# EAGLE board TellitShieldV45JR (EAGLE 5.11)
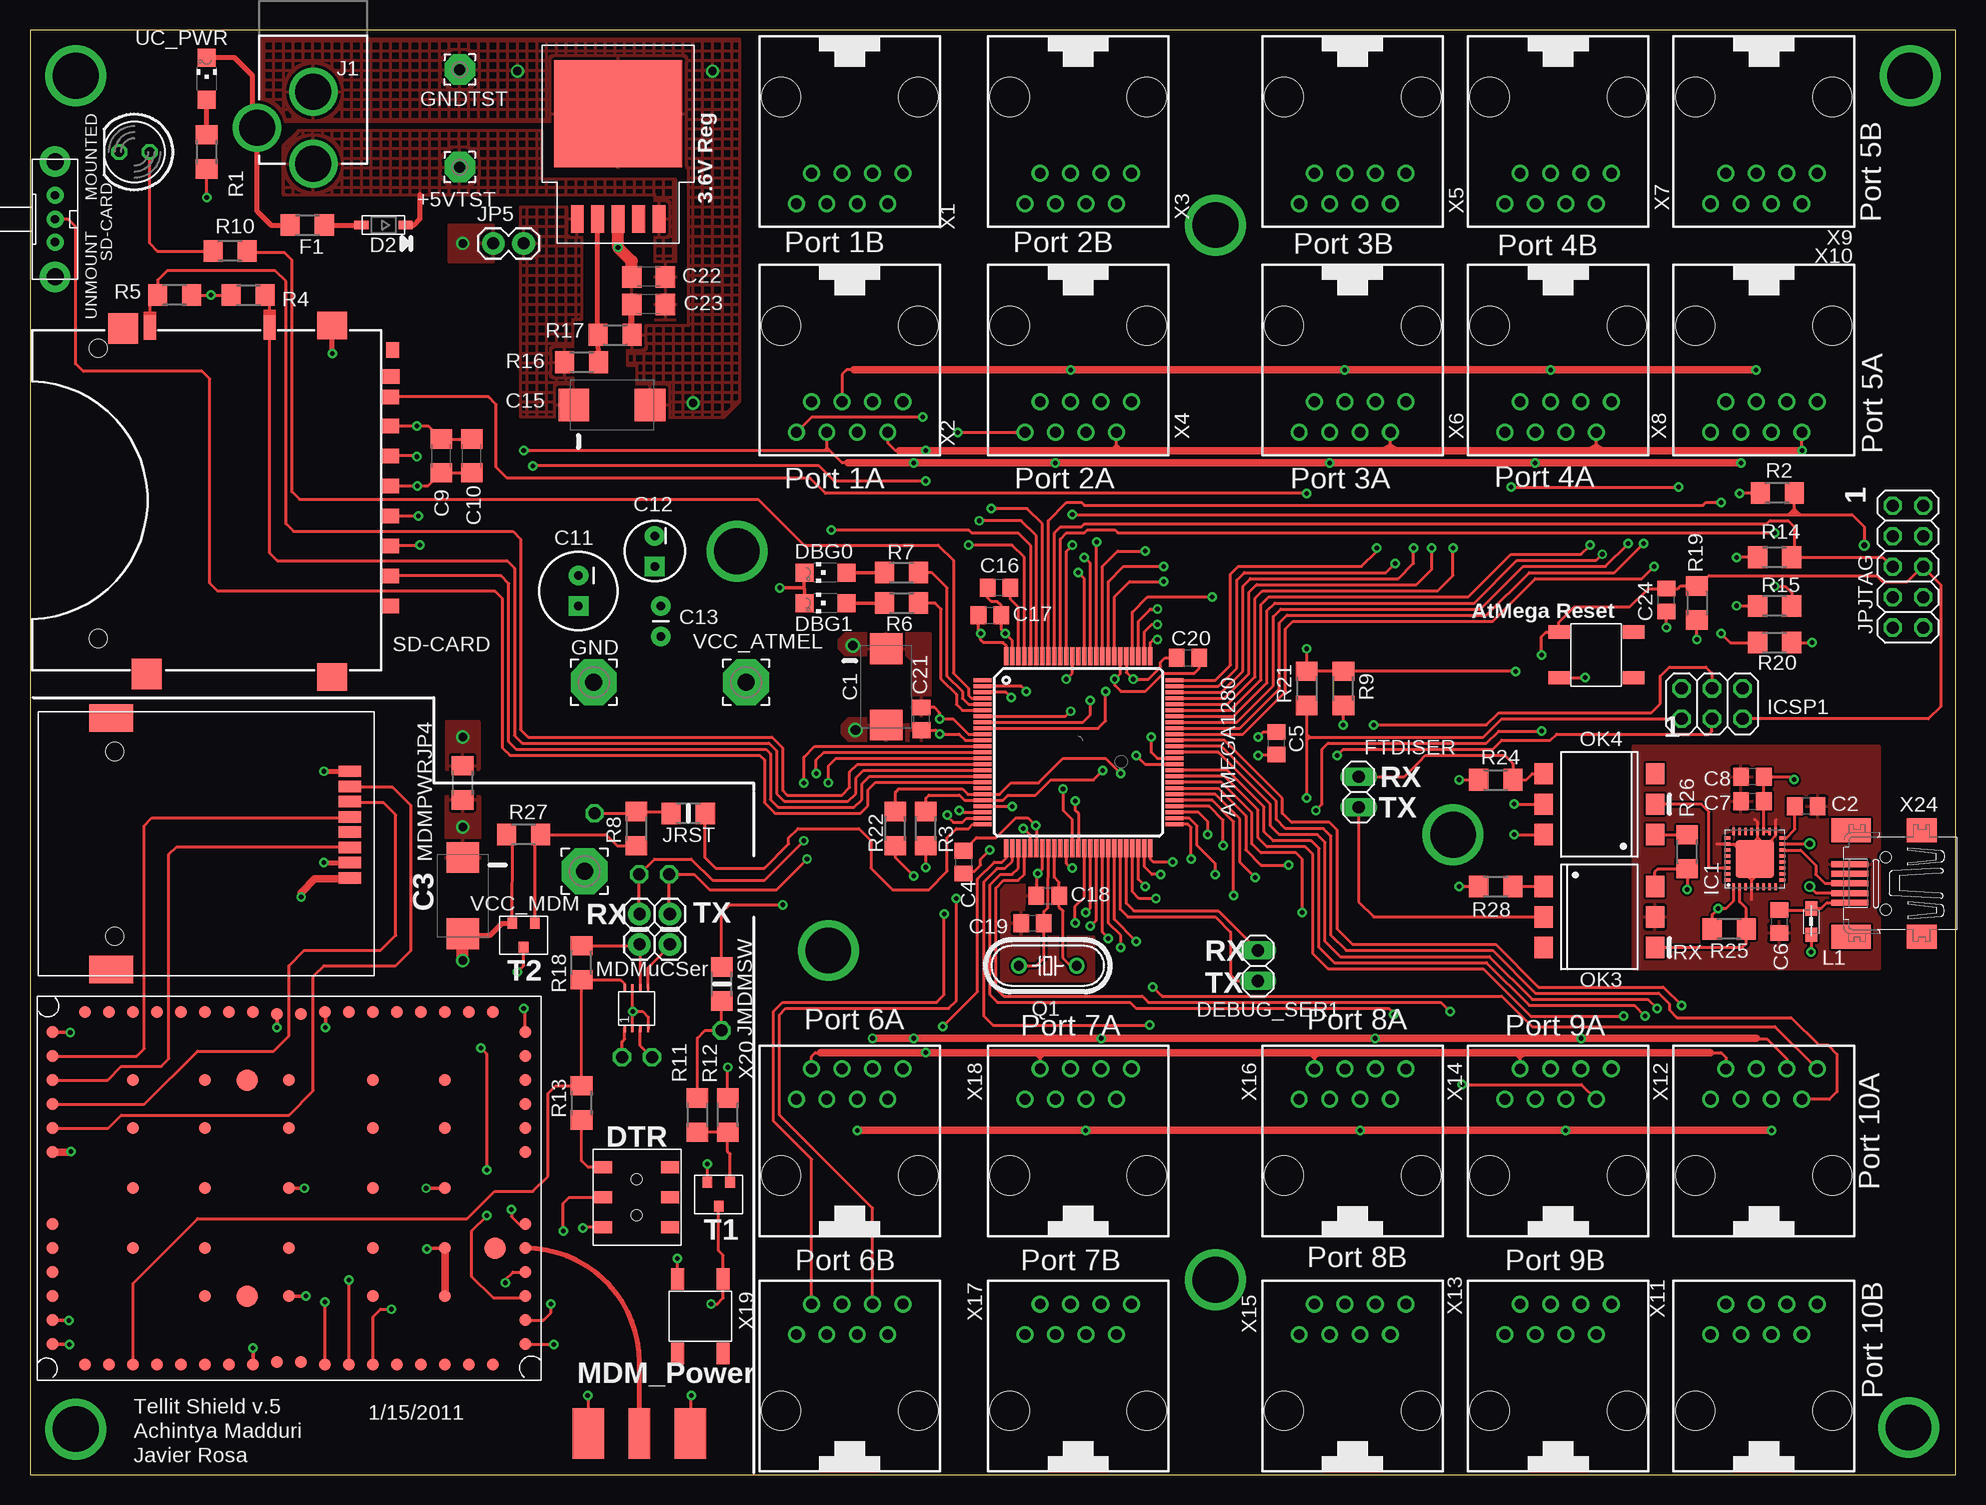
[diagram p2: board, top side]
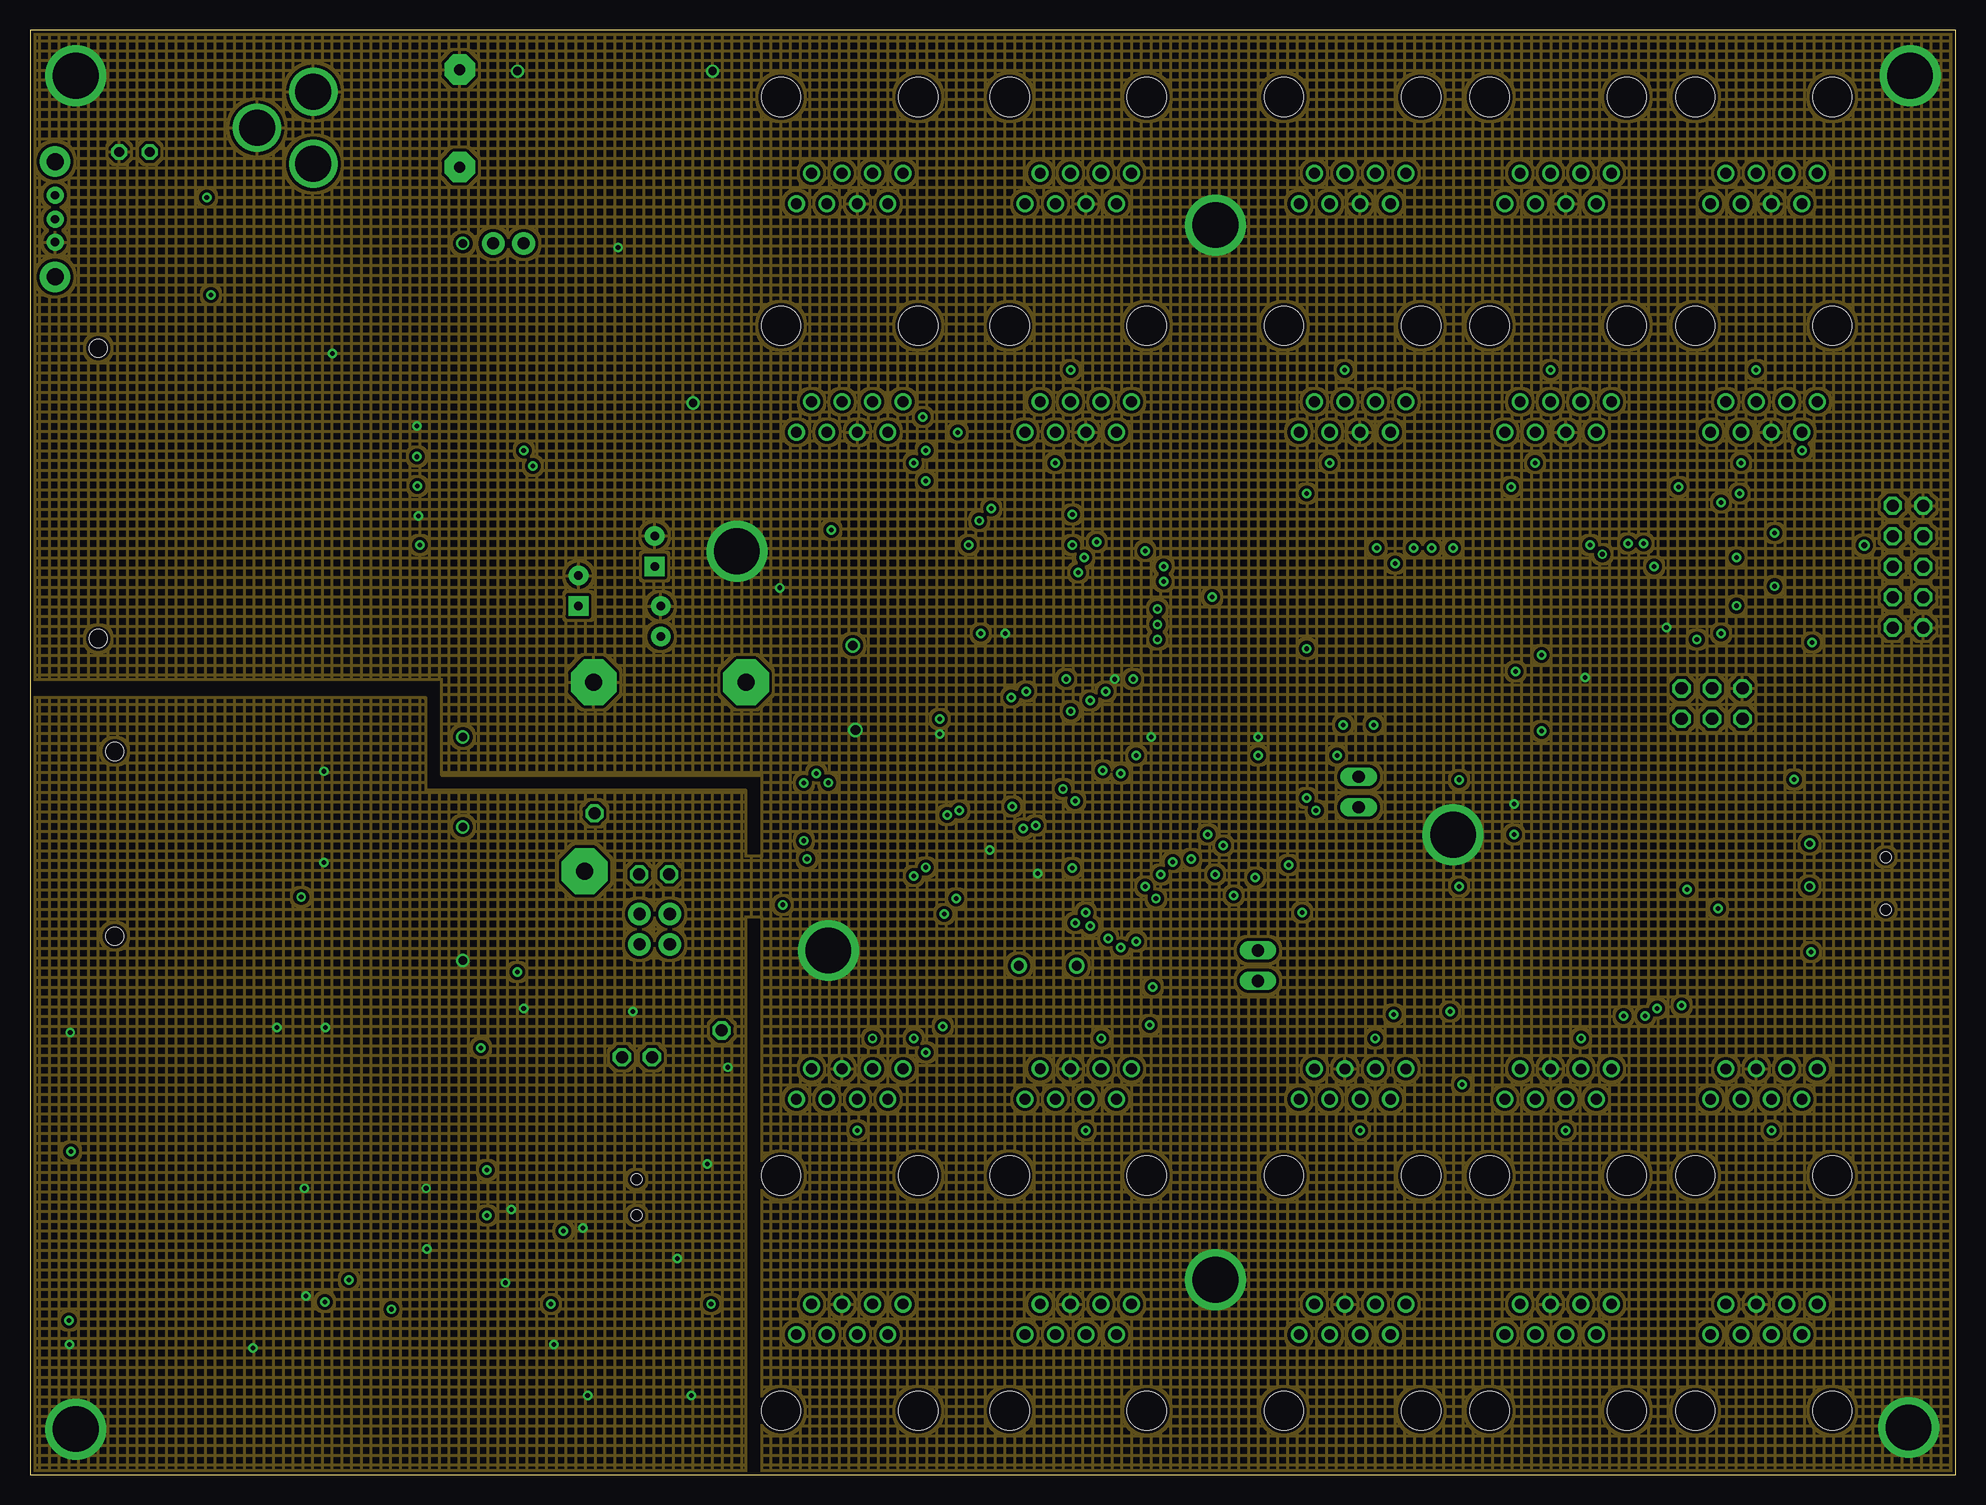
[diagram p3: board, inner layer GNDLayer]
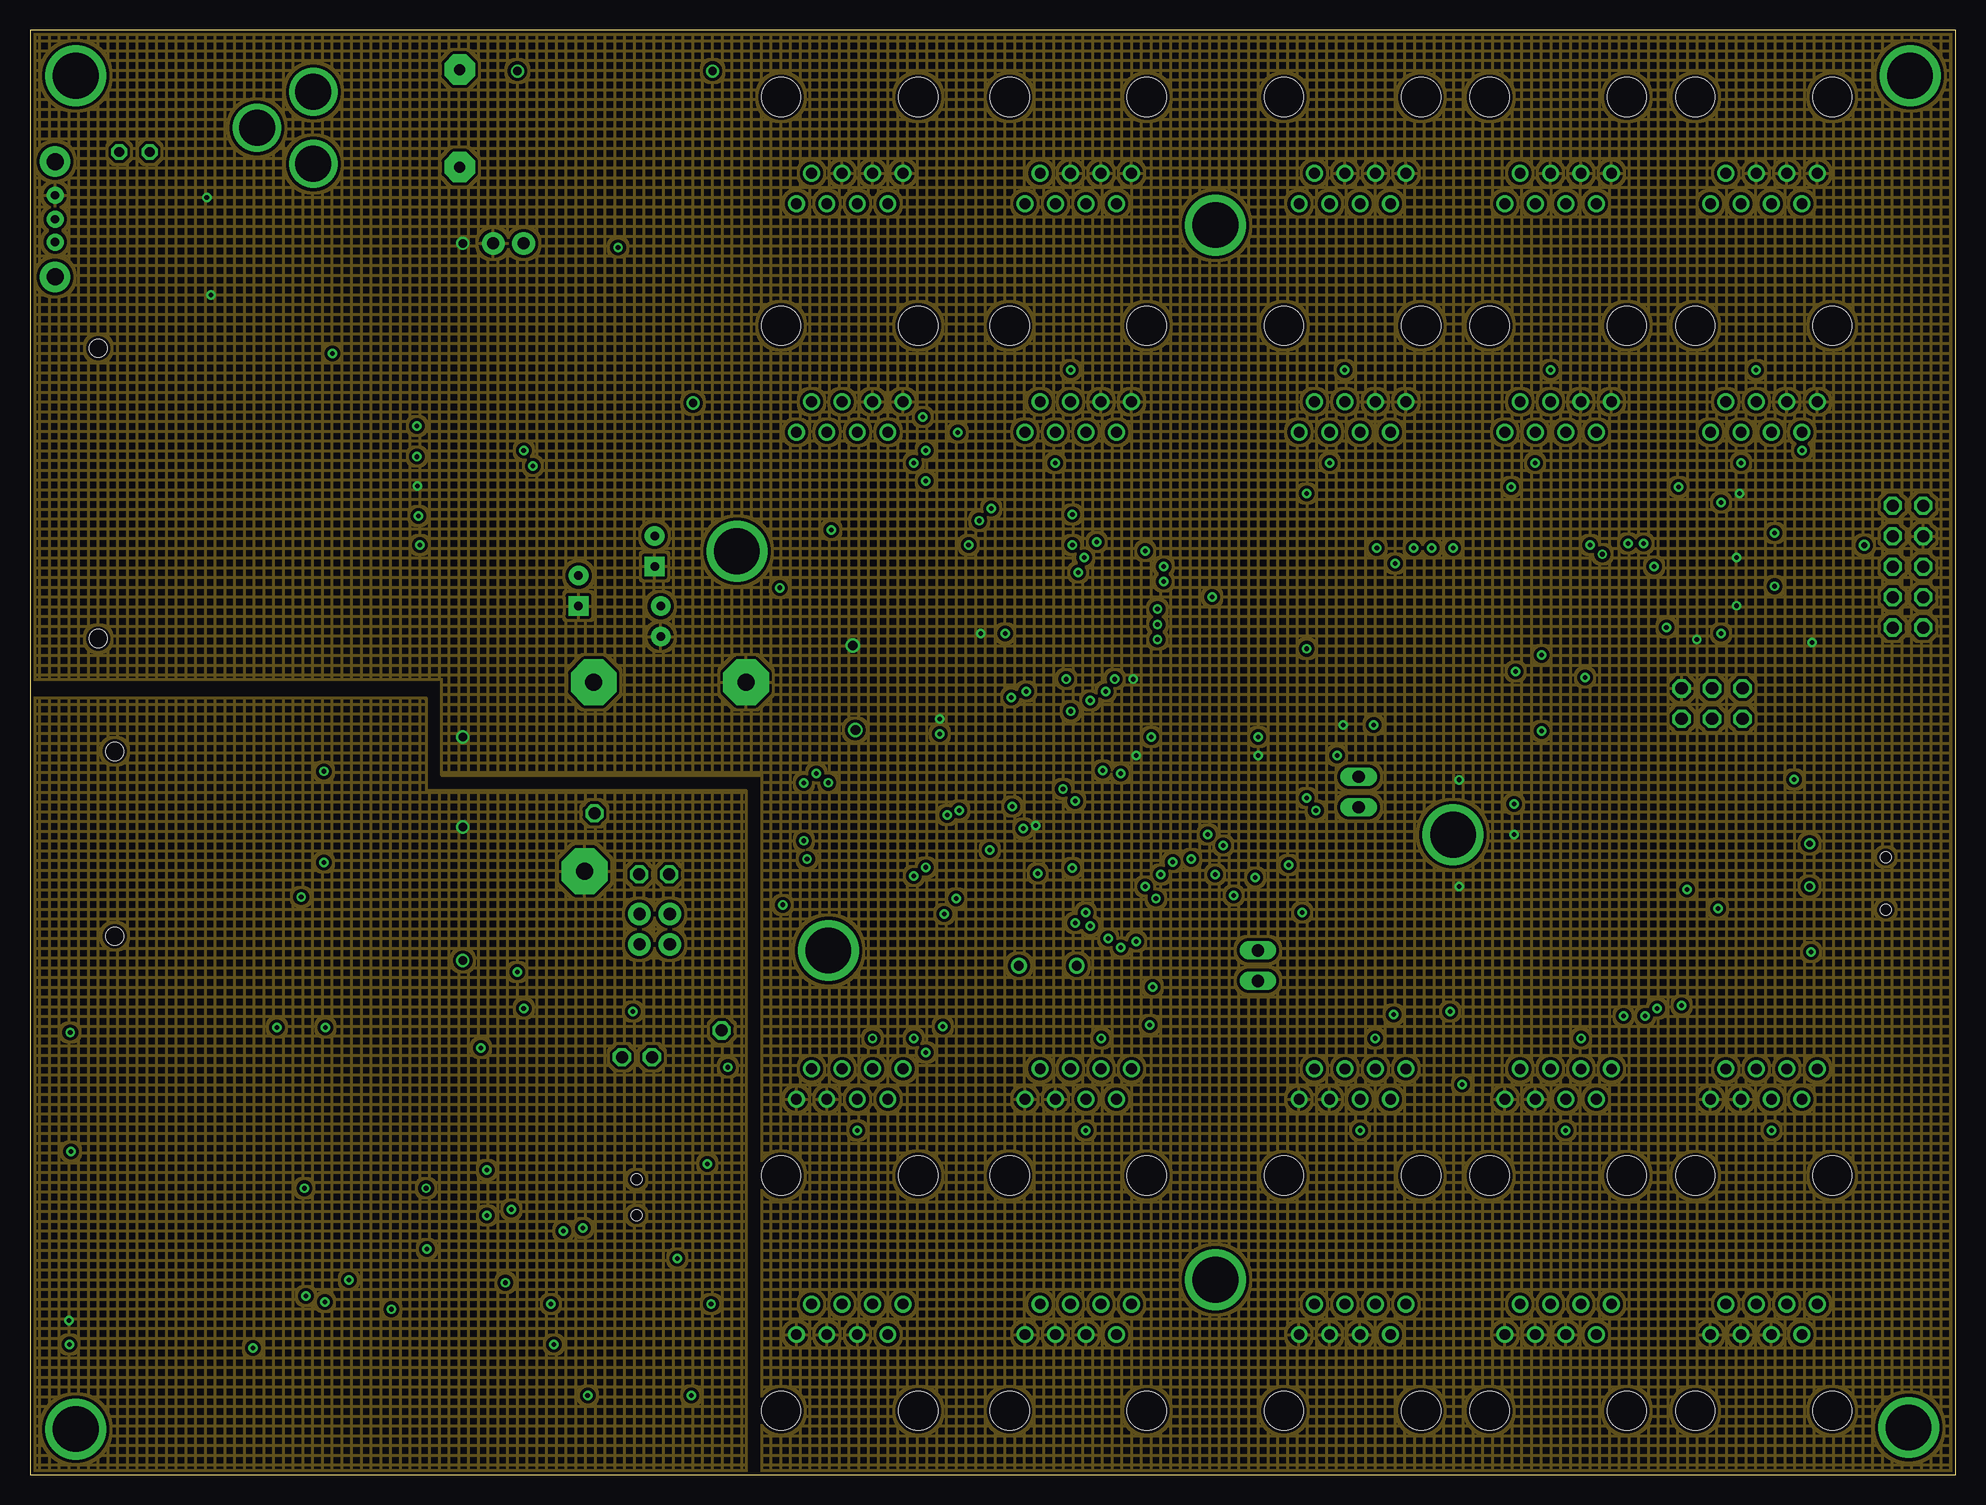
[diagram p4: board, inner layer VCC1-2Layer]
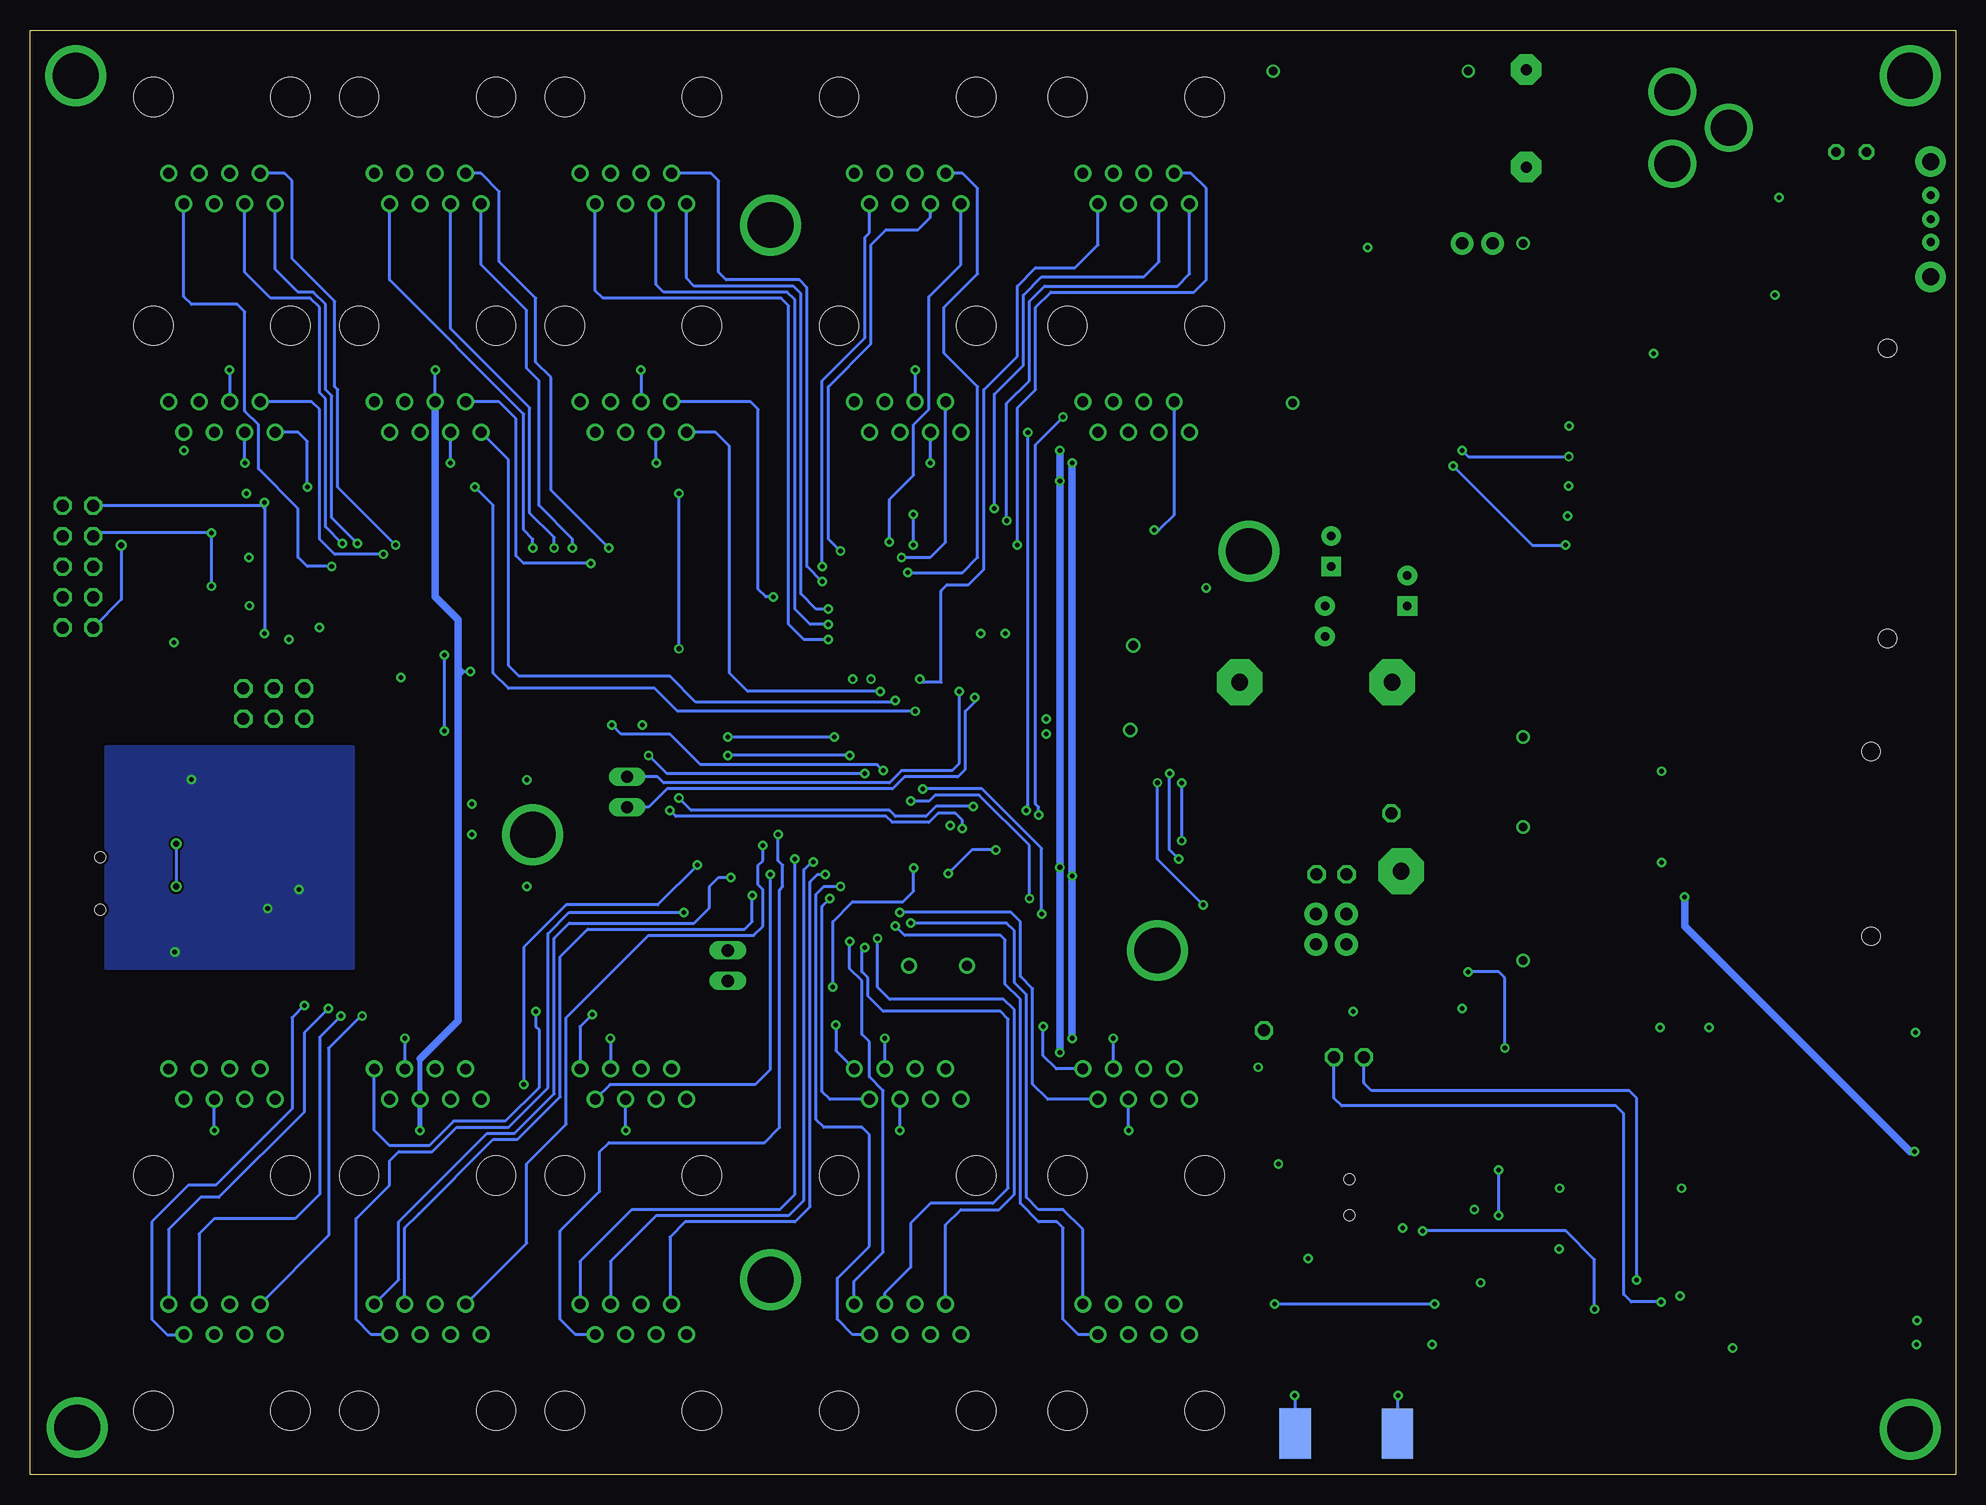
[diagram p5: board, bottom side, seen from below]

Size 160.53 x 120.4 mm. Coordinates in mm from the lower left corner, seen from the top.
Outline: 0,0 160.53,0 160.53,120.4 0,120.4 0,0
Copper layers (1+2*15+16): Top 0.035mm / dielectric 0.24mm / GNDLayer 0.035mm / dielectric 0.98mm / VCC1-2Layer 0.035mm / dielectric 0.25mm / Bottom 0.035mm
Design rules "4pcb_4layer *": minimum track width 7mil, minimum drill 15mil, track to track 6mil, track to pad 10mil, pad to pad 10mil, via to via 10mil, smd to smd 6mil, copper to edge 10mil, drill to drill 7mil, minimum pad ring 10mil, minimum via ring 8mil, stop-mask expansion 4mil, vias tented up to drill 0mil, thermal gap 10mil
Net classes: 0 default: width 0.152 mm, drill 0.381 mm, clearance 0.178 mm; 1 power: width 0.254 mm, drill 0.381 mm, clearance 0.178 mm; 2 gnd: width 0.254 mm, drill 0.381 mm, clearance 0.178 mm; 3 VCC: width 0.254 mm, drill 0.381 mm, clearance 0.178 mm; 4 aSignal: width 0.254 mm, drill 0.381 mm, clearance 0.178 mm
tRestrict: area 137.1,51.4 to 139.1,52.4; area 147.8,45.8 to 149.1,46.4; area 141.1,44.5 to 142.1,46.5

## Footprints (pad centres in the part's own frame; a part is rotated, then mirrored left to right if it is on the bottom)
2,54/0,9 = drill 0.914 pad 2.54 octagon: 1 0,0
TQFP100 = smd 1.5 x 0.35: 1 -8,6; 2 -8,5.5; 3 -8,5; 4 -8,4.5; 5 -8,4; 6 -8,3.5; 7 -8,3; 8 -8,2.5; 9 -8,2; 10 -8,1.5; 11 -8,1; 12 -8,0.5; 13 -8,0; 14 -8,-0.5; 15 -8,-1; 16 -8,-1.5; 17 -8,-2; 18 -8,-2.5; 19 -8,-3; 20 -8,-3.5; 21 -8,-4; 22 -8,-4.5; 23 -8,-5; 24 -8,-5.5; 25 -8,-6; 51 8,-6; 52 8,-5.5; 53 8,-5; 54 8,-4.5; 55 8,-4; 56 8,-3.5; 57 8,-3; 58 8,-2.5; 59 8,-2; 60 8,-1.5; 61 8,-1; 62 8,-0.5; 63 8,0; 64 8,0.5; 65 8,1; 66 8,1.5; 67 8,2; 68 8,2.5; 69 8,3; 70 8,3.5; 71 8,4; 72 8,4.5; 73 8,5; 74 8,5.5; 75 8,6 | smd 0.35 x 1.5: 26 -6,-8; 27 -5.5,-8; 28 -5,-8; 29 -4.5,-8; 30 -4,-8; 31 -3.5,-8; 32 -3,-8; 33 -2.5,-8; 34 -2,-8; 35 -1.5,-8; 36 -1,-8; 37 -0.5,-8; 38 0,-8; 39 0.5,-8; 40 1,-8; 41 1.5,-8; 42 2,-8; 43 2.5,-8; 44 3,-8; 45 3.5,-8; 46 4,-8; 47 4.5,-8; 48 5,-8; 49 5.5,-8; 50 6,-8; 76 6,8; 77 5.5,8; 78 5,8; 79 4.5,8; 80 4,8; 81 3.5,8; 82 3,8; 83 2.5,8; 84 2,8; 85 1.5,8; 86 1,8; 87 0.5,8; 88 0,8; 89 -0.5,8; 90 -1,8; 91 -1.5,8; 92 -2,8; 93 -2.5,8; 94 -3,8; 95 -3.5,8; 96 -4,8; 97 -4.5,8; 98 -5,8; 99 -5.5,8; 100 -6,8
D/7343-31R = smd 2.55 x 2.7: + 3.175,0; - -3.175,0
C0805 = smd 1.3 x 1.5: 1 -0.95,0; 2 0.95,0
C1206 = smd 1.6 x 1.8: 1 -1.4,0; 2 1.4,0
CPOL-RADIAL-100UF-25V = drill 0.7 pad 1.651 square: 1 1.27,0 | drill 0.7 pad 1.651 round: 2 -1.27,0
CPOL-RADIAL-10UF-25V = drill 0.7 pad 1.651 square: 1 1.27,0 | drill 0.7 pad 1.651 round: 2 -1.27,0
CAP-PTH-SMALL = drill 0.7 pad 1.651 round: 1 0,0; 2 2.54,0
SOD-123 = smd 1.2 x 0.7: A 1.85,0; C -1.85,0
CHIPLED_1206 = smd 1.5 x 1.5: A 0,-1.75; C 0,1.75
1X02 = drill 1.016 long: 1 -1.27,0; 2 1.27,0
R1206 = smd 1.6 x 1.803: 1 -1.422,0; 2 1.422,0
GE836 = smd 1 x 1: 1_GPIO13 -14.7,17; 2_GPIO12 -14.7,15; 3_GPIO11 -14.7,13; 4_GPIO10 -14.7,11; 5_GPIO9 -14.7,9; 6_GPIO8 -14.7,7; 7_RESERVED -14.7,5; 8_GND -14.7,3; 9_EAR_MT- -14.7,-3; 10_EAR_MT+ -14.7,-5; 11_EAR_HF+ -14.7,-7; 12_EAR_HF- -14.7,-9; 13_MIC_MT+ -14.7,-11; 14_MIC_MT- -14.7,-13; 15_MIC_HF+ -14.7,-15; 16_MIC_HF- -14.7,-17; 17_GND -13,-19.7; 18_SIMCLK -11,-19.7; 19_SIMRST -9,-19.7; 20_SIMIO -7,-19.7; 21_SIMIN -5,-19.7; 22_SIMVCC -3,-19.7; 23_ADC_IN1 3,-19.7; 24_VRTC 5,-19.7; 25_TX_TRACE 7,-19.7; 26_RX_TRACE 9,-19.7; 27_VBATT 11,-19.7; 28_GND 13,-19.7; 29_STAT_LED 14.7,-17; 30_AXE 14.7,-15; 31_VAUX1 14.7,-13; 32_GPIO4 14.7,-11; 33_GPIO2/JDR 14.7,-9; 34_GPIO1 14.7,-7; 35_CHARGE 14.7,-5; 36_GND 14.7,-3; 37_C103/TXD 14.7,3; 38_C104/RXD 14.7,5; 39_C108/DTR 14.7,7; 40_C105/RTS 14.7,9; 41_C106/CTS 14.7,11; 42_C109/DCD 14.7,13; 43_C107/DSR 14.7,15; 44_C125/RING 14.7,17; 45_GND 13,19.7; 46_ON_OFF 11,19.7; 47_RESET 9,19.7; 48_GND 7,19.7; 49_ANTENNA 5,19.7; 50_GND 3,19.7; 51_GPIO7/BUZZER -3,19.7; 52_PWRMON -5,19.7; 53_GPIO5/RFTXMON -7,19.7; 54_GPIO6/ALARM -9,19.7; 55_GPIO3 -11,19.7; 56_GND -13,19.7; 57_RESERVED -9,13; 58_CLK -9,7; 59_GPIO17 -9,0; 60_GPIO14 -9,-7; 61_MRST -9,-13; 62_RESERVED -5,13; 63_DAC_OUT -5,7; 64_GPIO16 -5,0; 65_RESERVED -5,-7; 66_MTSR -5,-13; 67_GND 0,13; 68_TX_GPS 0,7; 69_GND 0,0; 70_RESERVED 0,-7; 71_GPIO15 0,-13; 72_GND 5,13; 73_RX_GPS 5,7; 74_RESERVED 5,0; 75_PPS 5,-7; 76_GPIO18 5,-13; 77_GND 9,13; 78_RX_GPS_BIN 9,7; 79_GND 9,0; 80_TX_GPS_BIN 9,-7; 81_RESERVED -14.5,1; 82_GND -14.5,-1; 83_GPS_ANT 14.5,-1; 84_GND_GPS 14.5,1 | smd 1.8 x 1.8: P$85 5,17.2; P$86 9,-3.5; P$87 -9,-3.5
3,81/1,4 = drill 1.397 pad 3.81 octagon: 1 0,0
QFN32 = smd 0.6 x 0.3: 1 -2.3,1.75; 2 -2.3,1.25; 3 -2.3,0.75; 4 -2.3,0.25; 5 -2.3,-0.25; 6 -2.3,-0.75; 7 -2.3,-1.25; 8 -2.3,-1.75; 17 2.3,-1.75; 18 2.3,-1.25; 19 2.3,-0.75; 20 2.3,-0.25; 21 2.3,0.25; 22 2.3,0.75; 23 2.3,1.25; 24 2.3,1.75 | smd 0.3 x 0.6: 9 -1.75,-2.3; 10 -1.25,-2.3; 11 -0.75,-2.3; 12 -0.25,-2.3; 13 0.25,-2.3; 14 0.75,-2.3; 15 1.25,-2.3; 16 1.75,-2.3; 25 1.75,2.3; 26 1.25,2.3; 27 0.75,2.3; 28 0.25,2.3; 29 -0.25,2.3; 30 -0.75,2.3; 31 -1.25,2.3; 32 -1.75,2.3 | smd 3.2 x 3.2: EXP 0,0
2X03 = drill 1.016 octagon: 1 -2.54,-1.27; 2 -2.54,1.27; 3 0,-1.27; 4 0,1.27; 5 2.54,-1.27; 6 2.54,1.27
POWER_JACK_PTH = drill 2.997 round: GND 0,7.7; GNDBREAK 4.7,10.7; PWR 0,13.7
1X02' = drill 1.016 pad 1.88 round: 1 0,0; 2 2.54,0
2X05 = drill 1.016 octagon: 1 -5.08,-1.27; 2 -5.08,1.27; 3 -2.54,-1.27; 4 -2.54,1.27; 5 0,-1.27; 6 0,1.27; 7 2.54,-1.27; 8 2.54,1.27; 9 5.08,-1.27; 10 5.08,1.27
0805 = smd 1.2 x 1: 1 -1.1,0; 2 1.1,0
LED5MM = drill 0.813 octagon: A -1.27,0; K 1.27,0
DIL6-SMD = smd 1.78 x 1.52: 1 -2.54,-4.645; 2 0,-4.645; 3 2.54,-4.645; 4 2.54,4.645; 5 0,4.645; 6 -2.54,4.645
SWITCHPB_KPT-1187B = smd 1.8 x 1.1: 1IN -3.1,1.9; 2IN 3.1,1.9; 3OUT -3.1,-1.9; 4OUT 3.1,-1.9
HC49/S = drill 0.813 round: 1 -2.413,0; 2 2.413,0
RP-SMA_SMALL = smd 2.616 x 4.191: P$1 -4.255,2.413; P$2 4.255,2.413 | smd 2.616 x 4.191 bottom: P$3 -4.255,2.413 | smd 2.616 x 4.166 bottom: P$4 4.255,2.413 | smd 1.778 x 4.191: SIGNAL 0,2.413
2.5_2HEADER = drill 1 octagon: P$1 -2.48,0; P$2 0.02,0
SD-MMC_SOCKET-PP_SHORT_BUS = smd 1.2 x 1.5: 1 6.88,29.85; 2 4.38,29.85; 3 1.88,29.85; 4 -0.62,29.85; 5 -3.12,29.85; 6 -5.62,29.85; 7 -8.04,29.85; 8 -9.728,29.87; 9 9.38,29.85 | smd 2.54 x 2.5: 12 -13.735,7.6; 13 15.037,9.525 | smd 2.286 x 2.5: 14 -14,25; 15 15.3,25 | smd 2.032 x 1: CD -13.815,19.8 | smd 1.3 x 1.1: SW -11.938,30.048 | smd 2.032 x 1.05: WP -13.815,9.8 | hole 1.5: -12.1,5.5; 12.1,5.5
SIMCARD_5036 = smd 1.9 x 0.95: 1_VCC 0,2.84; 2_RESET 0,0.3; 3_CLOCK 0,-2.24; 4_GND 0,1.57; 5_VPP 0,-0.97; 6_I/O 0,-3.51; CD_1 0,-4.78; CD_2 0,-6.05 | smd 3.7 x 2.3: P$9 19.9,-10.47; P$10 19.9,10.47 | hole 1.5: 19.6,-7.7; 19.6,7.7
SWITCHSLIDE_EG1390 = smd 1 x 1.5: A1 -2.5,-5.6; A2 2.5,-5.6; ACOM 0,-5.6; B1 -2.5,0; B2 2.5,0; BCOM 0,0 | hole 0.889: -1.5,-2.8; 1.5,-2.8
SOT-23_MMBT4403 = smd 0.8 x 0.9: B -0.95,-1; C 0,1; E 0.94,-1
SSOP8 = smd 0.6 x 0.2: 1 -1.7,0.975; 2 -1.7,0.325; 3 -1.7,-0.325; 4 -1.7,-0.975; 5 1.7,-0.975; 6 1.7,-0.325; 7 1.71,0.325; 8 1.7,0.975
2.5_1HEADER = drill 1 octagon: P$1 0.06,0
Q-LT1528 = smd 1.067 x 2.286: GND 0,-4.318; OUTPUT -3.404,-4.318; SENCE -1.702,-4.318; SHDN 1.702,-4.318; VIN 3.404,-4.318 | smd 10.668 x 8.89: HEATSINK 0,4.445
EG1213 = drill 0.7 pad 1.422 round: 1 -2,0; 2 0,0; 3 1.9,0 | drill 1.4 pad 2.54 round: MT1 -4.8,0; MT2 4.8,0
RJ45-NO-SHIELD_VERT = drill 0.9 pad 1.4 round: 1 -4.445,6.35; 2 -3.175,8.89; 3 -1.905,6.35; 4 -0.635,8.89; 5 0.635,6.35; 6 1.905,8.89; 7 3.175,6.35; 8 4.445,8.89 | hole 3.251: -5.715,0; 5.715,0
32005-201 = smd 3.1 x 0.5: 1 3,1.6; 2 3,0.8; 3 3,0; 4 3,-0.8; 5 3,-1.6 | smd 2.5 x 2: M1 -3,-4.45; M2 -3,4.45 | smd 3.3 x 2: M3 2.9,4.45; M4 2.9,-4.45 | hole 0.9: 0,2.2; 0,-2.2

## Placement (x,y rotation side)
+5VTST  1031K-ND:1031K-ND  [2,54/0,9]  35.81,108.97 0 top
ATMEGA1280  ATMEGA1280-16AU: ATMEGA1280-16AU-ND  [TQFP100]  87.38,60.2 0 top
C1  100uF:495-1549-1-ND  [D/7343-31R]  71.37,65.66 90 top
C2  100n:490-1673-1-ND  [C0805]  148.06,55.7 180 top
C3  100uF:495-1549-1-ND  [D/7343-31R]  36.07,48.26 90 top
C4  100n:490-1673-1-ND  [C0805]  77.8,51.05 270 top
C5  100n:490-1673-1-ND  [C0805]  103.89,60.96 90 top
C6  10n:445-1348-1-ND  [C0805]  145.8,46.1 270 top
C7  100n:490-1673-1-ND  [C0805]  143.57,56.13 0 top
C8  4.7uF:587-1442-1-ND  [C0805]  143.57,58.17 180 top
C9  100nF:399-1249-1-ND  [C1206]  34.29,84.91 90 top
C10  100nF:399-1249-1-ND  [C1206]  36.83,84.91 90 top
C11  100 uF: P5152-ND  [CPOL-RADIAL-100UF-25V]  45.72,73.66 270 top
C12  10 uF: P5148-ND  [CPOL-RADIAL-10UF-25V]  52.07,76.96 270 top
C13  .1 uF: BC1148TR-ND  [CAP-PTH-SMALL]  52.58,69.85 90 top
C15  100uF:495-1549-1-ND  [D/7343-31R]  48.51,89.15 180 top
C16  100n:490-1673-1-ND  [C0805]  80.77,73.91 180 top
C17  100n:490-1673-1-ND  [C0805]  80.01,71.63 0 top
C18  22p:478-1308-1-ND  [C0805]  84.84,48.26 0 top
C19  22p:478-1308-1-ND  [C0805]  83.57,45.97 0 top
C20  100n:490-1673-1-ND  [C0805]  96.52,68.07 0 top
C21  100n:490-1673-1-ND  [C0805]  74.3,62.99 270 top
C22  39nf: 311-1207-1-ND(478-1390-1-ND (311-1243-1-ND))  [C1206]  51.56,99.82 180 top
C23  10uf:445-4043-1-ND(445-3943-1-ND/478-1625-1-ND)  [C1206]  51.56,97.54 180 top
C24  22p:478-1308-1-ND  [C0805]  136.4,72.9 90 top
D2  Zener: MMSZ5233B-FDICT-ND  [SOD-123]  29.46,104.14 180 top
DBG0  Green:754-1141-1-nd  [CHIPLED_1206]  66.29,75.18 90 top
DBG1  Red:754-1142-1-ND  [CHIPLED_1206]  66.29,72.64 90 top
DEBUG_SER1  2.5_2HEADER:A31112-ND  [1X02]  102.36,42.42 90 top
F1  NANOSMDC050F/13.2CT-ND  [R1206]  23.11,104.14 180 top
FTDISER  2.5_2HEADER:A31112-ND  [1X02]  110.75,56.89 270 top
GE863  GE836  [GE836]  21.59,23.88 270 top
GND  [3,81/1,4]  46.99,66.04 0 top
GNDTST  1031K-ND:1031K-ND  [2,54/0,9]  35.81,117.09 0 top
IC1  FT232RQ:768-1008-1-ND  [QFN32]  143.76,51.31 90 top
ICSP1  ICSP:609-3218-ND  [2X03]  140.21,64.26 0 top
J1  CP-102A-ND  [POWER_JACK_PTH]  23.62,122.94 180 top
JMDMSW  0.0:P0.0ECT-ND  [R1206]  57.66,40.89 270 top
JP5  2.5_2HEADER:A31112-ND  [1X02']  38.61,102.62 0 top
JPJTAG  JTAG:S9169-ND  [2X05]  156.53,75.67 270 top
JRST  0.0:P0.0ECT-ND  [R1206]  54.86,55.12 0 top
L1  40Ohm:240-2389-2-ND  [0805]  148.46,46.1 270 top
MDMPWRJP4  0.0:P0.0ECT-ND  [R1206]  36.07,57.66 270 top
MDMRX  2.5_2HEADER:A31112-ND  [1X02']  53.34,46.74 270 top
MDMTX  2.5_2HEADER:A31112-ND  [1X02']  50.8,44.2 90 top
MOUNT  YELLOW:365-1204-ND  [LED5MM]  8.71,110.23 180 top
OK3  H11L1SM:H11L1SM-ND  [DIL6-SMD]  130.81,46.48 270 top
OK4  H11L1SM:H11L1SM-ND  [DIL6-SMD]  130.81,55.88 90 top
POWER1  uSW:CKN9104CT-ND  [SWITCHPB_KPT-1187B]  55.88,13.21 90 top
Q1  16MHz:300-8499-ND  [HC49/S]  84.84,42.42 180 top
R1  100:P100ECT-ND  [R1206]  14.73,110.24 270 top
R2  10K:RMCF1206FT10K0CT-ND  [R1206]  145.65,81.8 0 top
R3  100:RMCF1206FT1K00CT-ND  [R1206]  74.68,53.85 270 top
R4  10K:RMCF1206FT10K0CT-ND  [R1206]  18.19,98.3 180 top
R5  10K:RMCF1206FT10K0CT-ND  [R1206]  12.06,98.3 0 top
R6  100:P100ECT-ND  [R1206]  72.64,72.64 180 top
R7  82:P82ECT-ND  [R1206]  72.64,75.18 180 top
R8  10K:RMCF1206FT10K0CT-ND  [R1206]  50.55,53.85 90 top
R9  1K:RMCF1206FT1K00CT-ND  [R1206]  109.47,65.53 270 top
R10  82:P82ECT-ND  [R1206]  16.69,101.97 0 top
R11  10K:RMCF1206FT10K0CT-ND  [R1206]  55.63,29.97 90 top
R12  47K:P47.0KFCT-ND  [R1206]  58.17,29.97 270 top
R13  47K:P47.0KFCT-ND  [R1206]  45.97,30.99 90 top
R14  10K:RMCF1206FT10K0CT-ND  [R1206]  145.42,76.45 0 top
R15  10K:RMCF1206FT10K0CT-ND  [R1206]  145.42,72.39 0 top
R16  27:P27.0FCT-ND  [R1206]  45.97,92.71 180 top
R17  270:P270FCT-ND  [R1206]  48.77,95 180 top
R18  47K:P47.0KFCT-ND  [R1206]  45.97,42.67 270 top
R19  10K:RMCF1206FT10K0CT-ND  [R1206]  138.94,72.64 90 top
R20  10K:RMCF1206FT10K0CT-ND  [R1206]  145.42,69.34 180 top
R21  1K:RMCF1206FT1K00CT-ND  [R1206]  106.43,65.53 90 top
R22  100:RMCF1206FT1K00CT-ND  [R1206]  72.14,53.85 270 top
R24  10K:RMCF1206FT10K0CT-ND  [R1206]  122.17,57.91 180 top
R25  1K:RMCF1206FT1K00CT-ND  [R1206]  141.63,45.47 0 top
R26  1.5K:P1.5KECT-ND  [R1206]  138.14,51.91 270 top
R27  47K:P47.0KFCT-ND  [R1206]  41.15,53.34 0 top
R28  1.2K:P1.2KECT-ND  [R1206]  122.17,49.02 180 top
RESET  uSW:CKN9104CT-ND  [SWITCHPB_KPT-1187B]  130.56,68.33 180 top
RP-SMA  SMAEDGE:ACX1426-ND  [RP-SMA_SMALL]  50.8,5.84 180 top
RX/TX_ATMEL  2.5_2HEADER:DNS  [2.5_2HEADER]  50.8,50.04 180 top
RX/TX_TELIT  2.5_2HEADER:DNS  [2.5_2HEADER]  51.82,34.8 0 top
SD-CARD  SD_CARD_SOCKETEASY_SOLDER  [SD-MMC_SOCKET-PP_SHORT_BUS]  0.19,81.78 270 top
SIM5036  SIMCARD_5036:478-5061-1-ND  [SIMCARD_5036]  26.67,52.58 180 top
SW1  SWITCHSLIDE_EG1390:EG4632CT-ND  [SWITCHSLIDE_EG1390]  47.75,23.11 90 top
T1  T1:MMBT2222A-FDICT-ND  [SOT-23_MMBT4403]  57.41,23.37 180 top
T2  T1:MMBT2222A-FDICT-ND  [SOT-23_MMBT4403]  41.15,44.96 180 top
TC7W125FU  Trans1:TC7W125FUTFCT-ND:  [SSOP8]  50.55,38.86 90 top
TELIT_ON/OFF  2.5_1HEADER:DNS  [2.5_1HEADER]  57.66,37.08 270 top
TELIT_ON/OFF1  [2.5_1HEADER]  46.99,55.12 0 top
U1  Q-LT1528:LT1528CQ#PBF-ND  [Q-LT1528]  49.02,108.97 0 top
UC_PWR  Red:754-1142-1-ND  [CHIPLED_1206]  14.73,116.33 0 top
UNMOUNTED  EG1213:EG1906-ND  [EG1213]  2.09,104.62 270 top
VCC_ATMEL  [3,81/1,4]  59.69,66.04 0 top
VCC_MDM  [3,81/1,4]  46.23,50.29 0 top
X1  RJ45-6L-B:A31428-ND  [RJ45-NO-SHIELD_VERT]  68.33,114.81 180 top
X2  RJ45-6L-B:A31428-ND  [RJ45-NO-SHIELD_VERT]  68.33,95.76 180 top
X3  RJ45-6L-B:A31428-ND  [RJ45-NO-SHIELD_VERT]  87.38,114.81 180 top
X4  RJ45-6L-B:A31428-ND  [RJ45-NO-SHIELD_VERT]  87.38,95.76 180 top
X5  RJ45-6L-B:A31428-ND  [RJ45-NO-SHIELD_VERT]  110.24,114.81 180 top
X6  RJ45-6L-B:A31428-ND  [RJ45-NO-SHIELD_VERT]  110.24,95.76 180 top
X7  RJ45-6L-B:A31428-ND  [RJ45-NO-SHIELD_VERT]  127.38,114.81 180 top
X8  RJ45-6L-B:A31428-ND  [RJ45-NO-SHIELD_VERT]  127.38,95.76 180 top
X9  RJ45-6L-B:A31428-ND  [RJ45-NO-SHIELD_VERT]  144.53,114.81 180 top
X10  RJ45-6L-B:A31428-ND  [RJ45-NO-SHIELD_VERT]  144.53,95.76 180 top
X11  RJ45-6L-B:A31428-ND  [RJ45-NO-SHIELD_VERT]  144.53,5.33 0 top
X12  RJ45-6L-B:A31428-ND  [RJ45-NO-SHIELD_VERT]  144.53,24.93 0 top
X13  RJ45-6L-B:A31428-ND  [RJ45-NO-SHIELD_VERT]  127.38,5.33 0 top
X14  RJ45-6L-B:A31428-ND  [RJ45-NO-SHIELD_VERT]  127.38,24.93 0 top
X15  RJ45-6L-B:A31428-ND  [RJ45-NO-SHIELD_VERT]  110.24,5.33 0 top
X16  RJ45-6L-B:A31428-ND  [RJ45-NO-SHIELD_VERT]  110.24,24.93 0 top
X17  RJ45-6L-B:A31428-ND  [RJ45-NO-SHIELD_VERT]  87.38,5.33 0 top
X18  RJ45-6L-B:A31428-ND  [RJ45-NO-SHIELD_VERT]  87.38,24.94 0 top
X19  RJ45-6L-B:A31428-ND  [RJ45-NO-SHIELD_VERT]  68.33,5.33 0 top
X20  RJ45-6L-B:A31428-ND  [RJ45-NO-SHIELD_VERT]  68.33,24.94 0 top
X24  MINI-USB-32005-201:H2959CT-ND  [32005-201]  154.69,49.28 180 top

## Tracks (layer width: path | path; a pad name or v marks a point on that pad's centre or on a via)
10(LED_UNMOUNTED)
  Top 0.254: ATMEGA1280.4 78.49,64.7 78.23,64.95 78.23,65.53 76.96,66.8 76.96,76.2 75.69,77.47 64.52,77.47 60.71,81.28 22.48,81.28 21.84,81.92 21.84,101.22 21.21,101.85 18.11,101.85
  Top 0.305: 18.11,101.85 R10.2
11(LDBG1)
  Top 0.254: ATMEGA1280.6 77.72,63.7 77.22,64.21 77.22,65.02 75.95,66.29 75.95,72.14 75.44,72.64 R6.1
12(LDBG0)
  Top 0.254: ATMEGA1280.5 78.23,64.2 77.72,64.71 77.72,65.28 76.45,66.55 76.45,73.91 75.18,75.18 R7.1
31_VAUX
  Top 0.254: GE863.31_VAUX1 8.59,15.96 13.97,21.34 36.45,21.34 38.73,23.62 41.91,23.62 43.18,24.89 43.18,31.77 43.81,32.41 R13.2 R18.2 | TC7W125FU.8 49.57,40.9 49.23,41.25 R18.2 | R18.2
+5V
  Top 0.406: D2.C 32,104.14 32.51,104.65 32.51,106.68
  pour Top (hatched): 21.08,106.68 52.07,106.68 52.07,96.27 53.85,96.27 53.85,107.95 42.67,107.95 42.67,112.01 22.35,112.01 21.08,110.74
AREF
  Top 0.254: ATMEGA1280.98 82.38,72.31 81.72,72.96 C16.1
CS00  (via drill 0.38)
  Top 0.254: ATMEGA1280.89 86.88,66.8 v86.37,66.29 v86.36,66.29
  Bottom 0.254: X1.2 71.5,102.49 73.41,100.58 76.71,100.58 78.23,99.06 78.23,93.22 81.03,90.42 81.03,75.44 82.3,74.17 84.07,74.17 84.58,73.66 84.58,66.04 86.11,66.04 v86.36,66.29
CS01  (via drill 0.38)
  Top 0.254: ATMEGA1280.94 84.38,79.25 83.11,80.52 v80.14,80.52
  Bottom 0.254: v80.14,80.52 80.14,90.04 77.72,92.46 77.72,98.3 76.2,99.82 67.69,99.82 66.42,101.09 X1.6
CS02  (via drill 0.38)
  Top 0.254: ATMEGA1280.83 89.88,74.42 91.15,75.69 v94.49,75.69
  Bottom 0.254: v94.49,75.69 94.49,91.19 90.93,94.74 90.93,103.12 90.55,103.5 X3.2
CS03  (via drill 0.38)
  Top 0.254: ATMEGA1280.84 89.38,75.69 90.65,76.96 v92.96,76.96
  Bottom 0.254: v92.96,76.96 93.98,77.98 93.98,90.68 90.42,94.23 90.42,102.49 89.15,103.76 86.49,103.76 85.47,104.78 X3.6
CS04  (via drill 0.38)
  Top 0.254: ATMEGA1280.76 93.38,69.34 93.63,69.6 v93.98,69.6
  Bottom 0.254: v93.98,69.6 96.01,69.6 97.28,70.87 97.28,97.41 97.92,98.04 112.78,98.04 113.41,98.68 X5.2
CS05  (via drill 0.38)
  Top 0.254: ATMEGA1280.77 92.88,70.23 93.51,70.87 v93.98,70.87
  Bottom 0.254: v93.98,70.87 95.5,70.87 96.77,72.14 96.77,97.92 97.41,98.55 107.7,98.55 108.33,99.19 X5.6
CS06  (via drill 0.38)
  Top 0.254: ATMEGA1280.71 99.82,64.2 102.11,66.48 102.11,73.03 102.74,73.66 117.35,73.66 118.62,74.93 v118.62,77.22
  Bottom 0.254: v118.62,77.22 118.62,77.98 119.38,78.74 119.38,88.39 130.56,99.57 X7.2
CS07  (via drill 0.38)
  Top 0.254: ATMEGA1280.72 99.57,64.7 101.6,66.73 101.6,73.53 102.23,74.17 115.57,74.17 116.84,75.44 v116.84,77.22
  Bottom 0.254: v116.84,77.22 116.84,78.11 118.87,80.14 118.87,88.9 125.48,95.5 X7.6
CS08  (via drill 0.38)
  Top 0.254: ATMEGA1280.66 101.09,61.7 104.65,65.25 104.65,70.48 105.28,71.12 121.92,71.12 125.48,74.68 134.37,74.68 v135.38,75.69
  Bottom 0.254: v135.38,75.69 137.41,75.69 138.18,76.45 138.18,80.52 141.48,83.82 141.48,87.5 142.62,88.65 142.62,96.9 143.26,97.54 147.07,97.54 147.7,98.17 X9.2
CS09  (via drill 0.38)
  Top 0.254: ATMEGA1280.67 100.84,62.2 104.14,65.5 104.14,70.99 104.78,71.63 121.41,71.63 124.97,75.18 132.08,75.18 v134.49,77.6
  Bottom 0.254: v134.49,77.6 135.89,78.99 135.89,89.66 136.4,90.17 136.4,97.28 137.16,98.04 140.46,98.04 142.62,100.2 X9.6
CS10  (via drill 0.38)
  Top 0.254: ATMEGA1280.59 99.57,58.2 102.36,55.4 102.36,53.09 103.12,52.32 106.3,52.32 106.93,51.69 106.93,43.43 108.2,42.16 121.16,42.16 125.09,38.23 v132.84,38.23
  Bottom 0.254: v132.84,38.23 132.97,38.23 135.64,35.56 135.64,19.94 X11.2
CS11  (via drill 0.38)
  Top 0.254: ATMEGA1280.60 99.82,58.7 102.87,55.65 102.87,53.59 103.63,52.83 106.81,52.83 107.44,52.2 107.44,43.94 108.71,42.67 121.41,42.67 124.97,39.12 133.73,39.12 v134.62,38.23
  Bottom 0.254: X11.6 146.43,20.07 145.16,21.34 138.43,21.34 136.4,23.37 136.4,36.45 v134.62,38.23
CS12  (via drill 0.38)
  Top 0.254: v99.44,52.45 99.44,54.55 98.3,55.7 ATMEGA1280.54
  Bottom 0.254: v99.44,52.45 99.44,51.18 99.82,50.8 99.82,49.15 99.44,48.77 99.44,45.72 100.2,44.96 108.97,44.96 115.82,38.1 115.82,29.21 119.13,25.91 119.13,19.3 X13.2
CS13  (via drill 0.38)
  Top 0.254: v100.33,48.26 100.33,54.42 98.55,56.2 ATMEGA1280.55
  Bottom 0.254: v100.33,48.26 100.33,46.1 100.97,45.47 114.05,45.47 116.33,43.18 116.33,31.5 119.89,27.94 121.92,27.94 128.14,21.72 129.29,20.57 X13.6
CS14  (via drill 0.38)
  Top 0.254: v94.23,50.04 93.51,50.04 92.88,50.67 ATMEGA1280.49
  Bottom 0.254: v94.23,50.04 94.87,50.04 95.5,49.4 95.5,22.35 96.77,21.08 105.92,21.08 107.19,19.81 107.19,14.22 X15.2
CS15  (via drill 0.38)
  Top 0.254: v95.25,51.05 93.63,51.05 93.38,51.31 ATMEGA1280.50
  Bottom 0.254: v95.25,51.05 95.38,51.05 96.01,50.42 96.01,22.86 97.28,21.59 108.33,21.59 112.14,17.78 X15.6
CS16  (via drill 0.38)
  Top 0.254: ATMEGA1280.42 89.38,45.21 v89.88,44.7
  Bottom 0.254: X17.2 84.2,20.83 82.93,22.1 79.76,22.1 78.49,23.37 78.49,38.73 79.38,39.62 88.87,39.62 89.88,40.64 v89.88,44.7
CS17  (via drill 0.38)
  Top 0.254: ATMEGA1280.43 89.92,52.16 89.92,45.97 90.93,44.96 v90.93,43.94
  Bottom 0.254: v90.93,43.94 91.19,43.69 91.19,41.91 90.68,41.4 90.68,39.88 89.41,38.61 79.63,38.61 78.99,37.97 78.99,23.88 80.26,22.61 85.47,22.61 87.12,20.95 87.12,17.27 89.28,15.11 X17.6
CS18  (via drill 0.38)
  Top 0.254: ATMEGA1280.37 86.87,52.2 86.87,54.61 86.11,55.37 v86.11,57.15 | v76.2,46.74 76.2,40.01 75.56,39.37 62.74,39.37 61.98,38.61 61.98,29.46 65.15,26.29 X19.2
  Bottom 0.254: v86.11,57.15 81.15,57.15 76.2,52.2 v76.2,46.74
CS19  (via drill 0.38)
  Top 0.254: v87.12,56.13 87.12,55.37 87.38,55.12 ATMEGA1280.38 | v77.22,48.01 77.22,39.5 76.58,38.86 62.99,38.86 62.48,38.35 62.48,29.97 70.23,22.23 X19.6
  Bottom 0.254: v77.22,48.01 77.22,52.45 81.41,56.64 85.09,56.64 85.6,56.13 v87.12,56.13
D42(SW_UNMOUNTED)
  Top 0.254: UNMOUNTED.2 3.17,104.62 3.81,103.99 3.81,92.58 4.45,91.95 14.35,91.95 14.99,91.31 14.99,74.3 15.62,73.66 38.73,73.66 39.37,73.03 39.37,60.58 40.01,59.94 60.83,59.94 61.21,59.56 61.21,56.01 62.1,55.12 69.22,55.12 69.85,55.75 69.85,57.06 70.48,57.7 ATMEGA1280.18
D47(SDSS)
  Top 0.254: ATMEGA1280.17 69.98,58.2 69.34,57.56 69.34,56.26 68.71,55.63 62.36,55.63 61.72,56.26 61.72,60.07 61.34,60.45 40.54,60.45 39.9,61.09 39.9,74.27 39.27,74.91 SD-CARD.1
  Top 0.305: SD-CARD.1
D48(WP)
  Top 0.254: ATMEGA1280.16 69.47,58.7 68.83,58.06 68.83,56.77 68.2,56.13 62.87,56.13 62.23,56.77 62.23,60.33 61.59,60.96 41.02,60.96 40.39,61.59 40.39,75.54 39.75,76.17 20.62,76.17 19.99,76.81 SD-CARD.CD 19.99,97.92 R4.1
  Top 0.406: SD-CARD.CD
D49(CD)
  Top 0.254: ATMEGA1280.15 68.96,59.2 68.33,58.56 68.33,57.28 67.69,56.64 63.12,56.64 62.74,57.02 62.74,60.58 61.85,61.47 41.53,61.47 40.89,62.1 40.89,77.98 40.26,78.61 21.97,78.61 21.34,79.25 21.34,99.44 20.45,100.33 11.43,100.33 10.64,99.54 R5.1 9.99,97.64 SD-CARD.WP
  Top 0.406: SD-CARD.WP 10.01,95.62
D50(MISO)-CPU  (via drill 0.38)
  Top 0.254: 106.43,61.47 106.68,61.47 | 106.68,61.47 121.16,61.47 122.68,62.99 ICSP1.1 | v106.43,56.39 106.43,61.21 | 106.43,61.21 106.43,61.47 | 106.43,61.47 106.43,61.72 | 106.43,61.21 106.68,61.47 | 106.68,61.47 106.43,61.72 | ATMEGA1280.22 v81.89,55.7 | 106.43,61.72 R21.1
  Bottom 0.254: v81.89,55.7 85.01,55.7 85.85,54.86 88.39,54.86 88.9,55.37 105.41,55.37 v106.43,56.39
D51(MOS1)-CPU  (via drill 0.38)
  Top 0.254: R3.1 74.68,56.39 74.93,56.64 77.47,56.64 77.91,56.2 ATMEGA1280.21 81.09,56.2 81.53,56.64 83.82,56.64 85.09,57.91 88.65,57.91 v89.41,58.67 | v112.01,62.48 121.41,62.48 122.43,63.5 135.13,63.5 135.89,64.26 135.89,66.55 136.65,67.31 139.7,67.31 140.21,66.8 ICSP1.4
  Bottom 0.254: v112.01,62.48 111.25,61.72 107.19,61.72 104.65,59.18 89.92,59.18 v89.41,58.67
D51(MOSI)  (via drill 0.38)
  Top 0.254: X20.2 65.15,34.87 65.46,35.18 65.91,35.18 | 107.06,35.18 107.06,34.67 | 107.06,34.67 X16.2 | 84.2,35.18 84.2,34.67 | 84.2,34.67 X18.2 | 124.21,35.18 124.21,34.67 | 124.21,34.67 X14.2 | 90.55,85.34 90.55,85.85 | 90.55,85.85 X4.2 | 130.56,85.34 130.56,85.85 | 130.56,85.85 X8.2 | 113.41,85.34 113.41,85.85 | 113.41,85.85 X6.2 | v147.7,85.34 X10.2 | 140.08,35.18 140.97,35.18 141.35,34.8 X12.2 | 72.49,85.34 72.14,85.34 71.5,85.98 X2.2 | 113.41,85.85 114.05,85.47 | 113.41,85.85 112.78,85.47 | 130.56,85.85 131.32,85.34 | 130.56,85.85 129.92,85.47 | 90.55,85.85 90.17,85.47 | 90.55,85.85 90.93,85.47 | 124.21,34.67 123.83,35.05 | 124.21,34.67 124.59,35.05 | 107.06,34.67 106.68,35.05 | 107.06,34.67 107.44,35.05 | 84.2,34.67 83.82,35.05 | 84.2,34.67 84.58,35.05 | v74.68,50.62 R3.2 | SD-CARD.2 32.44,77.4 v32.51,77.47 | v41.91,84.07 65.79,84.07 67.06,82.8 v74.68,82.8
  Top 0.61: 65.91,35.18 v74.68,35.18 84.2,35.18 107.06,35.18 124.21,35.18 140.08,35.18 | 72.49,85.34 v74.68,85.34 90.55,85.34 113.41,85.34 130.56,85.34 131.32,85.34 v147.7,85.34
  Bottom 0.254: v32.51,77.47 35.31,77.47 v41.91,84.07
  Bottom 0.61: v74.68,35.18 v74.68,50.62 v74.68,82.8 v74.68,85.34
D52(SCK)  (via drill 0.38)
  Top 0.254: 68.17,84.33 67.69,84.33 66.67,85.34 | 66.67,85.34 66.42,85.6 | 66.42,85.6 X2.6 | 143.89,36.37 143.94,36.32 144.78,36.32 146.43,34.67 X12.6 | R22.2 72.14,51.44 v73.66,49.91 | SD-CARD.5 32.19,84.9 v32.26,84.84 | 66.17,85.34 v41.15,85.34 | 66.42,85.6 66.17,85.34 | 66.67,85.34 66.17,85.34
  Top 0.61: v70.23,36.37 v73.66,36.37 v89.28,36.37 v112.14,36.37 v129.29,36.37 143.89,36.37 | 68.17,84.33 v73.66,84.33 v85.47,84.33 v108.33,84.33 v125.48,84.33 v142.62,84.33
  Bottom 0.254: v85.47,84.33 X4.6 | v108.33,84.33 X6.6 | v125.48,84.33 X8.6 | v129.29,36.37 X14.6 | v112.14,36.37 X16.6 | v89.28,36.37 X18.6 | X20.6 v70.23,36.37 | v32.26,84.84 40.64,84.84 v41.15,85.34 | v142.62,84.33 X10.6
  Bottom 0.61: v73.66,84.33 v73.66,49.91 v73.66,36.37
D52(SCK)-CPU  (via drill 0.38)
  Top 0.254: R22.1 72.14,56.9 72.39,57.15 77.72,57.15 78.18,56.7 ATMEGA1280.20 80.83,56.7 81.79,57.66 84.07,57.66 86.11,59.69 89.66,59.69 v90.93,58.42 | v108.97,59.94 109.47,60.45 121.92,60.45 122.68,61.21 126.75,61.21 127.25,61.72 139.95,61.72 140.21,61.98 ICSP1.3
  Bottom 0.254: v90.93,58.42 107.44,58.42 v108.97,59.94
DTR  (via drill 0.38)
  Top 0.254: 28.59,9.29 28.59,13.16 29.23,13.79 v30.12,13.79 | v44.45,20.32 44.45,22.61 44.96,23.11 SW1.BCOM
  Top 0.305: GE863.39_C108/DTR 28.59,9.29
  Bottom 0.254: v30.12,13.79 30.12,17.93 32.51,20.32 v44.45,20.32
GND  (via drill 0.38, 0.7, 0.8, 3.81 pad 5.08)
  Top 0.254: C18.1 83.89,49.98 v84,50.09 84.38,50.47 ATMEGA1280.32 | SD-CARD.6 v32.23,87.4 33.2,87.4 C9.2 C10.2 | GE863.45_GND v43.66,10.88 v43.66,10.87 | SD-CARD.3 32.36,79.9 | ATMEGA1280.62 93.97,59.7 93.47,60.2 v93.47,61.47 | ATMEGA1280.81 90.88,66.75 v90.42,66.29 90.42,65.79 90.93,65.28 92.96,65.28 94.49,66.8 97.05,66.8 97.47,67.22 C20.2 | v129.61,66.43 v129.62,66.43 RESET.2IN | v123.7,55.88 OK4.5 | ATMEGA1280.11 77.98,61.2 77.45,61.72 v75.82,61.72 75.5,62.04 C21.2 | v39.62,16 39.62,16.24 40.26,16.88 GE863.48_GND | v40.13,22.1 40.13,21.51 40.77,20.88 GE863.50_GND | RP-SMA.P$2 46.55,6.54 v46.48,6.6 | v55.12,6.6 55.05,6.54 RP-SMA.P$3 | GE863.56_GND 41.29,38.86 v41.15,38.86 | ATMEGA1280.99 81.88,69.51 v81.28,70.1 80.96,70.42 C17.2 80.96,72.46 80.64,72.77 80.14,72.77 79.82,73.09 C16.2 | C5.2 102.8,61.91 v102.36,61.47 | TC7W125FU.7 50.22,38.61 v50.24,38.61 | 50.24,38.91 50.55,38.61 v50.24,38.61 | v24.51,51 v24.52,51 v24.52,51.01 | v136.4,70.61 C24.1 | C23.2 50.16,97.41 | T2.E 40.23,52.79 R27.1 | R12.1 | R12.1 v58.17,33.96 | SW1.B1 46.14,20.61 v46.1,20.57 | POWER1.2IN v53.98,18.03 | T1.E v56.47,25.91 v56.46,25.91 | v80.01,52.07 79.25,51.31 79.25,50.8 78.74,50.29 78.49,50.29 78.29,50.1 C4.2 | TC7W125FU.4 51.52,38.14 51.05,38.61 v50.24,38.61 | TC7W125FU.2 v50.24,38.61
  Top 0.305: GE863.28_GND v3.28,10.88 v3.28,10.87 | GE863.36_GND v18.59,10.57 | GE863.79_GND 22.99,14.88 v22.99,14.91 | GE863.69_GND v22.86,23.88 | GE863.67_GND v33.02,23.88 | GE863.72_GND 33.07,18.88 v33.07,18.8 | GE863.8_GND 24.64,38.58 v24.64,37.29 | GE863.17_GND 3.35,36.88 v3.35,36.85 | 32.36,79.9 v32.36,79.88 | 64.54,73.91 v62.48,73.91 | 64.54,73.91 64.54,73.84 DBG1.C | DBG0.C 64.54,73.91 | v20.57,37.29 20.59,37.29 GE863.82_GND
  Top 0.406: SD-CARD.14 25.19,93.43 v25.2,93.42 | SIM5036.CD_2 v24.52,58.63 v24.51,58.62 | v24.52,51.01 SIM5036.4_GND | UC_PWR.C 17.04,118.09 18.54,116.59 18.54,112.62 J1.GNDBREAK 18.92,105.31 20.09,104.14 F1.2 | C3.- 36.2,44.96 38.35,44.96 39.35,45.96 T2.E
  Top 0.508: 50.16,95.12 50.16,97.41
  Top 0.61: GE863.77_GND GE863.72_GND
  Top 1.016: U1.GND v49.02,102.26 50.16,101.13 C22.2 | v36.07,42.85 C3.-
  Bottom 0.254: v46.48,6.6 46.55,6.54 RP-SMA.P$2 | RP-SMA.P$3 55.05,6.54 v55.12,6.6 | v80.01,52.07 82.02,52.07 v84,50.09 | v93.47,61.47 v102.36,61.47
  other vias: 55.27,89.31 56.9,116.97 68.81,62.05 40.64,116.97 156.59,3.94 3.81,3.81 66.55,43.69 118.62,53.34 58.93,76.96 156.72,116.59 3.81,116.59 98.81,104.14 98.81,16.26
  pour Top: 84.35,49.12 81.03,49.12 81.03,41.15 88.65,41.15 88.65,44.83 82.8,44.81 82.8,47.65 84.35,47.65
  pour GNDLayer (isolate 0.254, hatched): 0,120.4 0,66.29 34.29,66.29 34.29,58.29 60.96,58.29 60.96,51.56 59.69,51.56 59.69,57.02 33.02,57.02 33.02,64.77 0,64.77 0,0 59.69,0 59.69,46.48 60.96,46.48 60.96,0 160.53,0 160.53,120.4
  pour Top (hatched): 43.69,112.78 43.69,108.97 54.86,108.97 54.86,95.76 49.78,95.76 49.78,92.46 50.55,92.46 50.55,88.14 57.91,88.14 59.18,89.41 59.18,119.63 19.3,119.63 19.3,112.78
  pour Top: 73.03,62.99 68.2,62.99 67.69,62.48 67.69,61.72 68.2,61.21 75.06,61.21 75.06,62.48 73.03,62.48
  pour Top: 49.53,100.33 49.53,96.77 50.8,96.77 50.8,100.33
  pour Top: 49.53,98.3 50.8,98.3 50.8,96.77 49.53,96.77
GSM_ON/OFF_I/O
  Top 0.254: R11.2 55.63,36.39 56.26,37.02 TELIT_ON/OFF.P$1 JMDMSW.2
GSM_RESET
  Top 0.254: TELIT_ON/OFF1.P$1 49.89,55.12 R8.2 53.29,55.27 JRST.1
INPUTMISO  (via drill 0.38)
  Top 0.254: SD-CARD.7 38.23,89.82 38.86,89.19 38.86,83.95 39.75,83.06 65.02,83.06 66.29,81.79 v106.43,81.79 | 68.71,92.08 68.07,92.08 67.69,91.69 X2.5 | v123.83,66.95 R9.1 R21.2 v106.43,68.83 | v123.83,66.95
  Top 0.61: v68.96,28.7 v88.01,28.7 v110.87,28.7 v128.02,28.7 v145.16,28.7 | 68.71,92.08 v86.74,92.08 v109.6,92.08 v126.75,92.08 v143.89,92.08
  Bottom 0.254: v106.43,68.83 v106.43,81.79 | v68.96,28.7 X20.5 | v88.01,28.7 X18.5 | v110.87,28.7 X16.5 | v145.16,28.7 X12.5 | v86.74,92.08 X4.5 | v109.6,92.08 X6.5 | X8.5 v126.75,92.08 | v143.89,92.08 X10.5 | v123.83,66.95 124.84,66.95 124.84,66.8 124.71,66.8 124.71,66.55 124.33,66.93 124.71,67.31
  Bottom 0.406: v128.02,28.7 X14.5 128.02,34.67
  Bottom 0.61: 124.84,66.95 124.84,71.25 126.75,73.15 X8.5 | 124.84,66.8 124.84,37.85 128.02,34.67
MDM-RST
  Top 0.254: JRST.2 56.29,51.41 57.15,50.55 61.21,50.55 63.25,52.58 63.25,53.09 64.01,53.85 69.09,53.85 70.1,52.83 70.1,50.55 71.88,48.77 74.93,48.77 76.45,50.29 76.45,53.09 77.22,53.85 78.23,53.85 78.58,54.2 ATMEGA1280.25
N$2
  Top 0.254: R28.1 OK3.1
  Top 0.406: OK3.1
N$5
  Top 0.254: SW1.B2 46.52,25.61 45.97,26.16 R13.1
N$6
  Top 0.254: 145.24,52.53 145.24,52.96
N$7
  Top 0.305: DBG1.A R6.2
N$8
  Top 0.305: DBG0.A R7.2
N$9
  Top 0.406: F1.1 D2.A
N$10
  Top 0.254: R8.1 48.92,52.43 48.01,53.34 R27.2 42.1,52.61 T2.B
N$11
  Top 0.254: MOUNT.A 9.98,102.61 10.62,101.97 R10.1
N$12  (via drill 0.38)
  Top 0.254: v38.1,21.59 36.83,20.32 36.83,16.51 38.61,14.73 41.15,14.73 GE863.47_RESET | v37.59,35.56 38.1,35.05 v38.1,25.4 | T2.C 41.15,42.42 v40.64,41.91
  Bottom 0.254: v38.1,21.59 v38.1,25.4 | v40.64,41.91 38.1,41.91 37.59,41.4 v37.59,35.56
N$13
  Top 0.254: R18.1 50.8,44.09 MDMTX.1 50.87,44.2 TC7W125FU.6
N$14
  Top 0.254: OK4.1 R26.1
N$15  (via drill 0.38)
  Top 0.254: GE863.46_ON_OFF 42.8,12.88 43.43,13.51 v43.43,14.22 | v56.77,14.22 57.27,14.22 57.78,14.73 POWER1.4OUT arc90 POWER1.4OUT 57.78,18.29 57.4,18.67 T1.C
  Bottom 0.254: v43.43,14.22 v56.77,14.22
N$16
  Top 0.406: GE863.49_ANTENNA arc-90 50.8,9.37 RP-SMA.SIGNAL
N$53
  Top 0.254: R11.1 R12.2 58.17,26.92 58.35,26.73 T1.B
N$126
  Top 0.406: R1.1 UC_PWR.A
NS3V3OUT
  Top 0.254: IC1.16 146.38,53.06 147.12,53.8 C2.2
OFF00  (via drill 0.38)
  Top 0.254: v66.8,78.74 78.23,78.74 78.49,78.49 82.36,78.49 83.38,77.47 ATMEGA1280.96
  Bottom 0.254: v66.8,78.74 66.42,78.74 65.15,80.01 X2.7
OFF01  (via drill 0.38)
  Top 0.254: ATMEGA1280.97 82.88,76.45 81.86,77.47 v78.23,77.47
  Bottom 0.254: v78.23,77.47 78.23,88.9 76.71,90.42 76.71,97.28 75.44,98.55 63.5,98.55 62.48,99.57 62.48,107.19 63.75,108.46 X1.7
OFF02  (via drill 0.38)
  Top 0.254: ATMEGA1280.86 88.38,75.96 v87.88,76.45
  Bottom 0.254: v87.88,76.45 85.47,76.45 84.2,77.72 X4.7
OFF03  (via drill 0.38)
  Top 0.254: ATMEGA1280.87 87.88,74.68 v87.38,75.18
  Bottom 0.254: v87.38,75.18 82.8,75.18 81.53,76.45 81.53,90.68 84.33,93.47 84.33,97.28 81.53,100.08 81.53,107.19 82.8,108.46 X3.7
OFF04  (via drill 0.38)
  Top 0.254: ATMEGA1280.79 91.88,71.88 93.15,73.15 v98.55,73.15
  Bottom 0.254: v98.55,73.15 99.19,73.15 99.82,73.79 99.82,88.77 100.46,89.41 X6.7
OFF05  (via drill 0.38)
  Top 0.254: ATMEGA1280.82 90.38,73.15 91.65,74.42 v94.49,74.42
  Bottom 0.254: v94.49,74.42 95.76,75.69 95.76,98.93 96.39,99.57 102.49,99.57 103.12,100.2 103.12,107.82 103.76,108.46 X5.7
OFF06  (via drill 0.38)
  Top 0.254: ATMEGA1280.74 99.06,65.7 100.58,67.22 100.58,74.55 101.22,75.18 113.03,75.18 v113.79,75.95
  Bottom 0.254: v113.79,75.95 119.38,75.95 120.02,76.58 120.02,88.01 121.41,89.41 X8.7
OFF07  (via drill 0.38)
  Top 0.254: ATMEGA1280.75 98.81,66.2 100.08,67.47 100.08,75.06 100.71,75.69 111,75.69 112.27,76.96 v112.27,77.22
  Bottom 0.254: v112.27,77.22 117.09,82.04 117.09,91.44 118.36,92.71 118.36,98.04 121.41,101.09 121.41,106.93 122.94,108.46 X7.7
OFF08  (via drill 0.38)
  Top 0.254: ATMEGA1280.69 100.33,63.2 103.12,65.99 103.12,72.01 103.76,72.64 120.4,72.64 123.95,76.2 130.56,76.2 v131.06,76.71
  Bottom 0.254: v131.06,76.71 135.13,76.71 136.4,77.98 136.4,88.77 137.03,89.41 X10.7
OFF09  (via drill 0.38)
  Top 0.254: ATMEGA1280.70 100.08,63.7 102.62,66.24 102.62,72.52 103.25,73.15 119.89,73.15 123.44,76.71 129.29,76.71 v130.05,77.47
  Bottom 0.254: v130.05,77.47 134.87,82.3 134.87,90.42 135.13,90.68 135.13,97.79 138.68,101.35 138.68,107.82 139.32,108.46 X9.7
OFF10
  Top 0.254: ATMEGA1280.64 99.31,60.7 103.89,56.13 103.89,54.61 104.65,53.85 107.82,53.85 108.46,53.21 108.46,44.96 109.73,43.69 121.92,43.69 125.48,40.13 135.76,40.13 136.65,39.24 136.65,38.73 137.29,38.1 146.81,38.1 149.1,35.81 149.86,35.81 150.62,35.05 150.62,31.92 149.99,31.28 X12.7
OFF11  (via drill 0.38)
  Top 0.254: ATMEGA1280.65 99.57,61.2 104.39,56.37 104.39,55.12 105.16,54.36 108.33,54.36 108.97,53.72 108.97,45.47 110.24,44.2 122.17,44.2 125.73,40.64 136.14,40.64 v137.67,39.12
  Bottom 0.254: X11.7 149.1,11.68 150.37,12.95 150.37,21.08 147.32,24.13 145.03,24.13 138.68,30.48 138.68,38.1 v137.67,39.12
OFF12  (via drill 0.38)
  Top 0.254: ATMEGA1280.57 99.06,57.2 101.35,54.91 101.35,52.07 102.62,50.8 v104.9,50.8 | X14.7 129.32,32.51 v119.38,32.51
  Bottom 0.254: v104.9,50.8 108.2,47.5 115.82,47.5 119.38,43.94 v119.38,32.51
OFF13  (via drill 0.38)
  Top 0.254: ATMEGA1280.58 99.31,57.7 101.85,55.16 101.85,52.58 102.62,51.82 105.54,51.82 106.05,51.31 v106.05,46.86
  Bottom 0.254: v106.05,46.86 115.57,46.86 117.35,45.09 117.35,32.26 120.65,28.96 124.97,28.96 127,26.92 129.79,26.92 130.56,26.16 130.56,24.13 133.35,21.34 133.35,12.95 132.08,11.68 X13.7
OFF14  (via drill 0.38)
  Top 0.254: ATMEGA1280.52 96.65,54.7 97.28,54.06 97.28,52.45 98.81,50.93 v98.81,50.04
  Bottom 0.254: X16.7 112.18,32.51 100.08,32.51 98.81,33.78 v98.81,50.04
OFF15  (via drill 0.38)
  Top 0.254: v98.17,53.34 98.17,54.44 97.41,55.2 ATMEGA1280.53
  Bottom 0.254: v98.17,53.34 98.17,51.18 97.79,50.8 97.79,49.02 98.04,48.77 98.04,28.96 99.31,27.69 112.27,27.69 113.03,26.92 113.03,23.62 116.33,20.32 116.33,12.95 115.06,11.68 X15.7
OFF16  (via drill 0.38)
  Top 0.254: v93.85,48.01 92.46,48.01 91.88,48.59 ATMEGA1280.47
  Bottom 0.254: X18.7 93.85,31.29 94.49,31.92 94.49,47.37 v93.85,48.01
OFF17  (via drill 0.38)
  Top 0.254: v92.96,49.02 92.38,49.61 ATMEGA1280.48
  Bottom 0.254: v92.96,49.02 94.36,49.02 95,48.39 95,29.59 94.36,28.96 91.19,28.96 90.55,28.32 90.55,19.05 93.22,16.38 93.22,12.95 91.95,11.68 X17.7
OFF18  (via drill 0.38)
  Top 0.254: v88.01,46.86 88.38,47.23 ATMEGA1280.40
  Bottom 0.254: X20.7 75.69,31.29 76.96,32.56 76.96,40.51 77.98,41.53 77.98,46.1 78.74,46.86 v88.01,46.86
OFF19  (via drill 0.38)
  Top 0.254: v88.39,45.72 88.88,46.2 ATMEGA1280.41
  Bottom 0.254: v88.39,45.72 87.63,44.96 79.63,44.96 79.25,44.58 79.25,40.89 77.98,39.62 77.98,22.61 76.45,21.08 74.93,21.08 74.42,20.57 74.42,12.95 73.15,11.68 X19.7
ON00  (via drill 0.38)
  Top 0.254: ATMEGA1280.24 78.07,54.7 77.72,54.36 76.96,54.36 76.45,54.86 v76.45,54.99 | v74.42,88.14 65.15,88.14 X2.8
  Bottom 0.254: v76.45,54.99 76.45,55.63 76.71,55.88 76.71,85.85 v74.42,88.14
ON01  (via drill 0.38)
  Top 0.254: ATMEGA1280.95 83.88,78.23 82.61,79.5 v79.12,79.5
  Bottom 0.254: v79.12,79.5 79.12,89.28 77.22,91.19 77.22,97.79 75.95,99.06 64.9,99.06 63.88,100.08 X1.8
ON02  (via drill 0.38)
  Top 0.254: v77.34,86.87 X4.8 | v77.47,55.37 77.64,55.2 ATMEGA1280.23
  Bottom 0.254: v77.47,55.37 77.34,55.5 v77.34,86.87
ON03  (via drill 0.38)
  Top 0.254: ATMEGA1280.85 88.88,77.72 v88.9,77.72
  Bottom 0.254: v88.9,77.72 88.9,81.28 86.87,83.31 86.87,87.5 85.6,88.77 85.6,98.17 82.93,100.84 X3.8
ON04  (via drill 0.38)
  Top 0.254: ATMEGA1280.9 89.03,62.2 89.66,62.83 v89.66,65.28
  Bottom 0.254: v89.66,65.28 100.71,65.28 102.23,66.8 102.23,85.72 103.38,86.87 X6.8
ON05  (via drill 0.38)
  Top 0.254: ATMEGA1280.78 92.38,71.12 93.39,72.14 v93.98,72.14
  Bottom 0.254: v93.98,72.14 95,72.14 96.27,73.41 96.27,98.42 96.9,99.06 105.16,99.06 105.79,99.69 X5.8
ON06  (via drill 0.38)
  Top 0.254: ATMEGA1280.8 87.76,62.7 88.39,63.33 v88.39,64.52
  Bottom 0.254: v88.39,64.52 88.52,64.39 105.03,64.39 107.19,66.55 119.76,66.55 120.65,67.44 120.65,84.58 X8.8
ON07  (via drill 0.38)
  Top 0.254: ATMEGA1280.73 99.31,65.2 101.09,66.98 101.09,74.04 101.73,74.68 114.05,74.68 115.32,75.95 v115.32,77.22
  Bottom 0.254: v115.32,77.22 115.32,77.98 118.11,80.77 118.11,91.19 119.13,92.2 119.13,97.03 122.94,100.84 X7.8
ON08  (via drill 0.38)
  Top 0.254: ATMEGA1280.7 86.31,63.2 v86.74,63.63 | v123.44,82.3 v137.41,82.3
  Bottom 0.254: v86.74,63.63 106.55,63.63 108.46,65.53 120.65,65.53 121.92,66.8 121.92,80.77 v123.44,82.3 | v137.41,82.3 137.41,86.11 138.18,86.87 X10.8
ON09  (via drill 0.38)
  Top 0.254: ATMEGA1280.68 100.58,62.7 103.63,65.75 103.63,71.5 104.27,72.14 120.9,72.14 124.46,75.69 131.32,75.69 v133.22,77.6
  Bottom 0.254: v133.22,77.6 135.38,79.76 135.38,89.92 135.89,90.42 135.89,97.54 136.91,98.55 138.18,98.55 140.08,100.46 X9.8
ON10  (via drill 0.38)
  Top 0.254: v86.87,50.55 86.76,50.55 86.38,50.93 ATMEGA1280.36 | v93.6,40.64 94.36,39.88 122.68,39.88 125.22,37.34 145.45,37.34 X12.8
  Bottom 0.254: v86.87,50.55 86.87,48.64 87.76,47.75 91.95,47.75 93.6,46.1 v93.6,40.64
ON11  (via drill 0.38)
  Top 0.254: ATMEGA1280.63 99.06,60.2 103.38,55.88 103.38,54.1 104.14,53.34 107.31,53.34 107.95,52.7 107.95,44.45 109.22,43.18 121.67,43.18 125.22,39.62 134.87,39.62 v135.64,38.86
  Bottom 0.254: v135.64,38.86 137.67,36.83 137.67,30.23 144.78,23.11 146.3,23.11 148.97,20.45 X11.8
ON12  (via drill 0.38)
  Top 0.254: ATMEGA1280.29 82.88,50.04 82.37,49.53 81.15,49.53 80.52,48.9 80.52,40.51 81.15,39.88 92.71,39.88 93.22,39.37 117.6,39.37 v118.36,38.61
  Bottom 0.254: X14.8 131.83,28.7 130.56,27.43 127.25,27.43 125.22,29.46 120.9,29.46 118.11,32.26 118.11,37.08 118.36,37.34 v118.36,38.61
ON13  (via drill 0.38)
  Top 0.254: v102.11,49.78 100.84,51.05 100.84,54.67 98.81,56.7 ATMEGA1280.56
  Bottom 0.254: v102.11,49.78 103.12,49.78 103.89,49.02 103.89,47.24 105.16,45.97 115.57,45.97 116.84,44.7 116.84,31.75 120.14,28.45 122.43,28.45 129.79,21.08 129.79,16.26 X13.8
ON14  (via drill 0.38)
  Top 0.254: ATMEGA1280.28 82.38,50.55 81.87,50.04 80.9,50.04 80.01,49.15 80.01,40.01 80.64,39.37 91.69,39.37 92.2,38.86 113.28,38.86 113.67,38.48 v113.67,38.35
  Bottom 0.254: v113.67,38.35 114.68,37.34 X16.8
ON15  (via drill 0.38)
  Top 0.254: v96.77,51.31 96.77,53.94 96.52,54.2 ATMEGA1280.51
  Bottom 0.254: v96.77,51.31 96.77,23.37 98.04,22.1 110.36,22.1 114.68,17.78 X15.8
ON16  (via drill 0.38)
  Top 0.254: ATMEGA1280.27 81.88,51.14 81.28,50.55 80.64,50.55 79.5,49.4 79.5,38.23 80.26,37.47 v93.34,37.47
  Bottom 0.254: v93.34,37.47 93.34,35.35 X18.8
ON17  (via drill 0.38)
  Top 0.254: v92.2,44.45 90.38,46.28 ATMEGA1280.44
  Bottom 0.254: v92.2,44.45 92.2,42.16 91.19,41.15 91.19,36.7 90.55,36.07 90.55,33.15 89.41,32 89.41,18.54 91.82,16.13 X17.8
ON18  (via drill 0.38)
  Top 0.254: ATMEGA1280.26 81.38,51.4 81.03,51.05 80.39,51.05 78.99,49.66 78.99,40.26 v76.07,37.34
  Bottom 0.254: v76.07,37.34 76.07,34.92 74.98,33.83 X20.8
ON19  (via drill 0.38)
  Top 0.254: v87.12,45.97 87.12,47.38 87.88,48.13 ATMEGA1280.39
  Bottom 0.254: v87.12,45.97 79.12,45.97 78.49,45.34 78.49,41.02 77.47,40.01 77.47,23.11 76.45,22.1 74.42,22.1 72.77,20.45 X19.8
OUTPUT
  pour Top (hatched): 40.89,105.66 45.97,105.66 45.97,96.27 45.21,96.27 45.21,88.14 40.89,88.14
PE0(RXFTDITX)  (via drill 0.38)
  Top 0.254: v83.06,65.28 82.64,65.7 ATMEGA1280.2 | OK4.4 125.91,58.42 125.22,58.42 124.71,57.91 R24.1 123.6,59.28 122.94,59.94 116.33,59.94 115.82,59.44 115.82,59.43 114.55,58.16 FTDISER.1
  Bottom 0.254: v83.06,65.28 83.06,59.31 83.69,58.67 87.88,58.67 88.9,57.66 107.7,57.66 108.2,58.17 FTDISER.1
PE1(TXFTDIRX)  (via drill 0.38)
  Top 0.254: v81.79,64.77 81.36,65.2 ATMEGA1280.3 | OK3.2 112.01,46.48 110.74,47.75 FTDISER.2
  Bottom 0.254: v81.79,64.77 81.79,64.39 82.55,63.63 82.55,58.8 83.19,58.17 87.63,58.17 88.65,57.15 107.44,57.15 108.97,55.63 FTDISER.2
PH2(GSM_ON/OFF)  (via drill 0.38)
  Top 0.254: v66.55,57.67 66.55,59.06 67.18,59.7 ATMEGA1280.14 | v62.74,47.5 58.29,47.5 57.66,46.86 JMDMSW.1
  Bottom 0.254: v62.74,47.5 66.55,51.31 v66.55,57.67
RESET  (via drill 0.38)
  Top 0.254: ICSP1.5 158.24,62.99 159.26,64.01 159.26,74.17 157.81,75.62 | v107.19,55.37 107.7,55.88 107.7,60.45 108.2,60.96 121.41,60.96 122.43,61.98 v125.98,61.98 | v125.98,68.33 125.98,69.85 126.36,70.23 RESET.4OUT 127.46,71.04 128.73,72.31 133.35,72.31 134.88,73.85 C24.2 137.35,73.85 137.57,74.07 R19.2 139.45,74.57 139.45,74.68 139.7,74.68 139.95,74.93 153.92,74.93 154.43,74.42 156.46,74.42 157.72,75.67 JPJTAG.6 | ATMEGA1280.30 83.38,53.28 v82.8,53.85
  Top 0.406: JPJTAG.6 157.81,75.62
  Bottom 0.254: v107.19,55.37 106.68,54.86 89.15,54.86 88.65,54.36 85.6,54.36 84.84,55.12 83.39,55.12 82.8,54.53 v82.8,53.85 | v125.98,61.98 v125.98,68.33
RXD  (via drill 0.38)
  Top 0.254: GE863.38_C104/RXD v26.59,16.23 | TC7W125FU.1 49.57,36.33 49.34,36.1 RX/TX_TELIT.P$1
  Top 0.305: GE863.38_C104/RXD 26.59,9.17
  Bottom 0.254: v26.59,16.23 26.59,31.37 27.23,32 48.7,32 49.34,32.64 RX/TX_TELIT.P$1
RXD1
  Top 0.254: DEBUG_SER1.1 100.58,41.15 100.08,41.66 100.08,45.21 98.81,46.48 91.51,46.48 90.88,47.12 ATMEGA1280.45
RXD3(MDMTX)  (via drill 0.38)
  Top 0.254: v64.52,52.83 61.21,49.53 56.9,49.53 55.12,51.31 52.05,51.31 RX/TX_ATMEL.P$2 50.78,46.76 MDMTX.2 | v64.52,57.65 64.52,59.81 65.41,60.7 ATMEGA1280.12
  Bottom 0.254: v64.52,52.83 v64.52,57.65
SENCE
  Top 0.254: R17.2 47.35,95.25 47.32,95.25
  Top 0.406: 47.32,95 47.32,95.25 U1.SENCE | R16.1 47.37,95 R17.2
SIMCLOCK
  Top 0.254: 26.59,54.74 10.16,54.74 9.53,54.1 9.53,35.51 8.89,34.88 GE863.18_SIMCLK
  Top 0.406: 26.59,54.74 SIM5036.3_CLOCK
SIMIN
  Top 0.254: GE863.21_SIMIN 6.52,28.88 7.62,29.97 21.59,29.97 23.62,32 23.62,41.53 24.51,42.42 30.48,42.42 31.75,43.69 31.75,55.75 30.23,57.28 26.75,57.28
  Top 0.406: 26.75,57.28 SIM5036.CD_1
SIMIO
  Top 0.254: GE863.20_SIMIO 9.54,30.88 13.97,35.31 20.32,35.31 21.59,36.58 21.59,42.42 22.86,43.69 29.21,43.69 30.48,44.96 30.48,54.99 29.46,56.01 26.75,56.01
  Top 0.406: 26.75,56.01 SIM5036.6_I/O
SIMRESET
  Top 0.254: GE863.19_SIMRST 6.46,32.88 7.62,34.04 10.95,34.04 11.58,34.67 11.58,51.69 12.22,52.32 26.62,52.32
  Top 0.406: 26.62,52.32 SIM5036.2_RESET
SIMVCC  (via drill 0.38)
  Top 0.61: GE863.22_SIMVCC 3.38,26.88 v3.43,26.92 | v22.61,48.13 22.61,48.51 23.75,49.66 26.59,49.66 SIM5036.1_VCC
  Bottom 0.61: v3.43,26.92 3.81,26.92 22.61,45.72 v22.61,48.13
TCK  (via drill 0.38)
  Top 0.254: ATMEGA1280.93 84.88,79.5 86.4,81.03 87.63,81.03 87.88,80.77 139.45,80.77 139.7,81.03 v140.97,81.03 140.72,81.03 | 144.02,68.86 R20.2 141.73,69.34 v140.97,70.1
  Bottom 0.254: 140.97,80.52 v140.97,81.03 141.22,80.77 | 140.97,80.52 v140.97,70.1 | 141.22,80.77 141.24,80.75 JPJTAG.1 | 140.97,80.52 141.22,80.77
TDI  (via drill 0.38, 0.51)
  Top 0.254: v86.89,80.01 146.56,80.01 | 146.56,80.01 147.07,80.52 | 147.07,80.52 R2.2 | ATMEGA1280.90 86.38,76.95 v86.89,77.47 | 146.56,80.01 146.81,80.01 | 146.81,80.01 147.32,80.01 | 147.57,80.01 151.89,80.01 152.91,78.99 v152.91,77.47 | 147.07,80.52 147.57,80.01 | 147.32,80.01 147.57,80.01 | 147.32,80.01 147.07,80.26 146.81,80.01
  Top 0.305: R2.2
  Bottom 0.254: v86.89,77.47 v86.89,80.01 | v152.91,77.47 152.91,72.95 JPJTAG.9
TDO  (via drill 0.38)
  Top 0.254: v145.41,78.49 90.68,78.49 90.42,78.74 88.14,78.74 87.88,78.49 86.39,78.49 85.88,77.98 ATMEGA1280.91 | 146.84,72.87 R15.2 146.84,73.51 146.3,74.04 v145.41,74.04
  Bottom 0.254: v145.41,74.04 v145.41,78.49 154.94,78.49 155.21,78.21 JPJTAG.3
TMS
  Top 0.254: ATMEGA1280.92 85.38,78.49 85.88,78.99 87.63,78.99 87.88,79.25 144.78,79.25 145.03,79.5 146.56,79.5 147.07,78.99 147.07,76.46 | 147.1,76.46 R14.2 147.09,76.45 154.43,76.45 155.21,75.67 JPJTAG.5
  Top 0.305: 147.07,76.46 R14.2
TXD  (via drill 0.38)
  Top 0.254: GE863.37_C103/TXD v24.59,14.4 | RX/TX_TELIT.P$2 50.87,35.76 TC7W125FU.3
  Bottom 0.254: v24.59,14.4 27.05,14.4 27.69,15.04 27.69,30.1 28.32,30.73 51.18,30.73 51.84,31.39 RX/TX_TELIT.P$2
TXD1
  Top 0.254: DEBUG_SER1.2 99.06,46.99 92.01,46.99 91.38,47.62 ATMEGA1280.46
TXD3(MDMRX)  (via drill 0.38)
  Top 0.254: v64.77,51.31 62.23,48.77 56.64,48.77 55.37,50.04 RX/TX_ATMEL.P$1 53.28,46.8 MDMRX.1 | v65.53,58.42 65.53,59.56 66.17,60.2 ATMEGA1280.13
  Bottom 0.254: v64.77,51.31 65.53,52.07 v65.53,58.42
TXD_IN
  Top 0.254: TC7W125FU.5 51.52,42.25 53.34,44.07 MDMRX.2
USB5VP1
  Top 0.254: X24.1 149.78,47.68 149.31,47.2 L1.1 148.31,47.05 C6.1 145.82,47.2
USB+5V  (via drill 0.38)
  Top 0.254: IC1.1 142.01,47.83 141.38,47.19 v140.72,47.19 140.21,46.69 R25.1 | IC1.18 IC1.19 C7.2 | L1.2 v148.46,43.56 | OK3.6 135.46,50.23 135.71,50.49 R26.2 v138.14,48.77 v138.12,48.77 | C7.2 | v147.05,57.92 146.81,58.17 C8.1 C7.2
  pour Bottom: 133.6,60.71 133.6,42.16 154.18,42.16 154.18,60.71
USBDM  (via drill 0.51)
  Top 0.254: X24.2 151.65,48.51 148.84,48.51 v148.34,49.02 | IC1.15 146.08,52.58 v148.34,52.58
  Bottom 0.254: v148.34,52.58 v148.34,49.02
USBDP
  Top 0.254: IC1.14 147.59,52.06 148.84,50.8 148.84,50.04 149.61,49.28 X24.3
USBGND
  Top 0.254: IC1.4 | 140.57,52.56 140.56,52.56 IC1.26 141.99,52.56 | 143.51,47.93 IC1.4 | 143.76,54.61 144.01,54.36 IC1.20 144.01,53.09 | 145.54,54.61 145.51,54.58 IC1.17 145.51,53.29 145.52,53.29 | 141.99,52.56 142.24,52.58 | 141.99,52.56 142.24,52.32 | 144.01,53.09 143.76,52.83 | 144.01,53.09 144.27,52.83 | IC1.4 143.51,49.53 | 143.51,49.53 143.76,49.78 | 143.51,49.53 143.26,49.78 | 145.52,53.29 IC1.17 | 145.52,53.29 145.06,52.81
  pour Top: 133.6,60.71 133.6,42.16 154.18,42.16 154.18,60.71
USBRX
  Top 0.254: IC1.2 142.51,47.73 143.05,47.19 R25.2 143.05,44.25 142.75,43.94 OK3.4
USBTX
  Top 0.254: OK4.2 139.32,55.88 139.95,55.24 139.95,50.56 IC1.30
VCC  (via drill 0.38, 0.7, 0.8)
  Top 0.254: v138.94,69.6 R19.1 | R2.1 142.49,81.8 v142.49,81.76 | ATMEGA1280.80 91.38,66.87 v91.95,66.29 93.22,66.29 94.23,67.31 94.23,67.69 94.61,68.07 C20.1 | SD-CARD.4 v32.28,82.4 33.17,82.4 C9.1 C10.1 | 15.09,98.3 v15.09,98.32 | v119.13,57.91 R24.2 | v123.7,53.34 OK4.6 | v119.13,49.02 R28.2 | ATMEGA1280.10 78.23,61.7 76.94,62.99 v75.82,62.99 75.82,63.5 75.38,63.94 C21.1 | ATMEGA1280.100 81.38,69.09 81.12,69.34 79.5,69.34 79.25,69.6 v79.25,70.1 79.06,70.29 C17.1 | ATMEGA1280.31 83.88,54.05 v83.82,54.1 83.19,54.74 82.17,54.74 80.52,53.09 78.89,53.09 C4.1 | C5.1 102.43,60.01 v102.36,59.94 | R14.1 v142.27,76.45 v142.26,76.45 | R15.1 142.26,72.39 v142.24,72.42 | R9.2 v109.47,62.48 | R20.1 v148.54,69.34 | ATMEGA1280.61 92.95,59.2 v92.2,59.94 | v14.73,106.43 R1.2 | 15.09,98.3 R4.2 | R5.2 15.09,98.3
  Top 0.406: R24.2 | R28.2
  Bottom 0.254: v92.2,59.94 v102.36,59.94
  other vias: 36.07,102.62 68.58,69.09 36.07,61.47
  pour VCC1-2Layer (isolate 0.254, hatched): 0,120.4 0,66.29 34.29,66.29 34.29,58.29 60.96,58.29 60.96,0 160.53,0 160.53,120.4
  pour Top: 34.92,104.14 38.61,104.14 38.61,101.09 34.92,101.09
  pour Top: 34.67,58.8 37.47,58.8 37.47,62.74 34.67,62.74
  pour Top: 75.06,70.1 67.94,70.1 67.44,69.6 67.44,68.83 67.94,68.33 73.03,68.33 73.53,67.82 73.53,63.25 75.06,63.25
VCC/2  (via drill 0.38, 0.7)
  Top 0.305: GE863.27_VBATT 3.25,12.88 v3.25,12.85
  other vias: 36.07,53.98
  pour VCC1-2Layer (isolate 0.254, hatched): 0,64.77 33.02,64.77 33.02,57.02 59.69,57.02 59.69,0 0,0
  pour Top: 34.67,51.05 34.67,56.52 37.47,56.52 37.47,51.05
XTAL1
  Top 0.254: Q1.1 86.74,42.42 86.11,43.05 86.11,46.99 85.79,47.31 C18.2 85.79,49.37 85.38,49.78 ATMEGA1280.34
XTAL2
  Top 0.254: Q1.2 83.88,42.42 84.52,43.05 C19.2 84.52,46.92 84.84,47.24 84.84,49.74 84.88,49.78 ATMEGA1280.33
(copper drawn outside any net)
  shapes: Top area x2

## Text on the board
tPlace: Port 5B | Port 1B | Port 2B | Port 3B | Port 4B | Port 5A | Port 1A | Port 2A | Port 3A | Port 4A | 1 | 1 | Port 6A | Port 7A | Port 8A | Port 9A | Port 10A | Port 6B | Port 7B | Port 8B | Port 9B | Port 10B
tNames: SD-CARD | MOUNTED | 3.6V Reg | UNMOUNT | C15 | AtMega Reset | C1 | RX | TX | C3 | RX | TX | RX | RX | MDMuCSer | T2 | TX | DTR | T1 | MDM_Power | Tellit Shield v.5 | 1/15/2011 | Achintya Madduri | Javier Rosa
201bmp: C:/Documents and Settings/javirosa/Desktop/bwork_12.bmp
Comments: Buffer acts as level translator by using High-Z output when MDM TX is High, leaving the output to be driven high by a level translator.